# EAGLE board SDA390V1_TASLAK (EAGLE 9.6.2), part 1 of 3
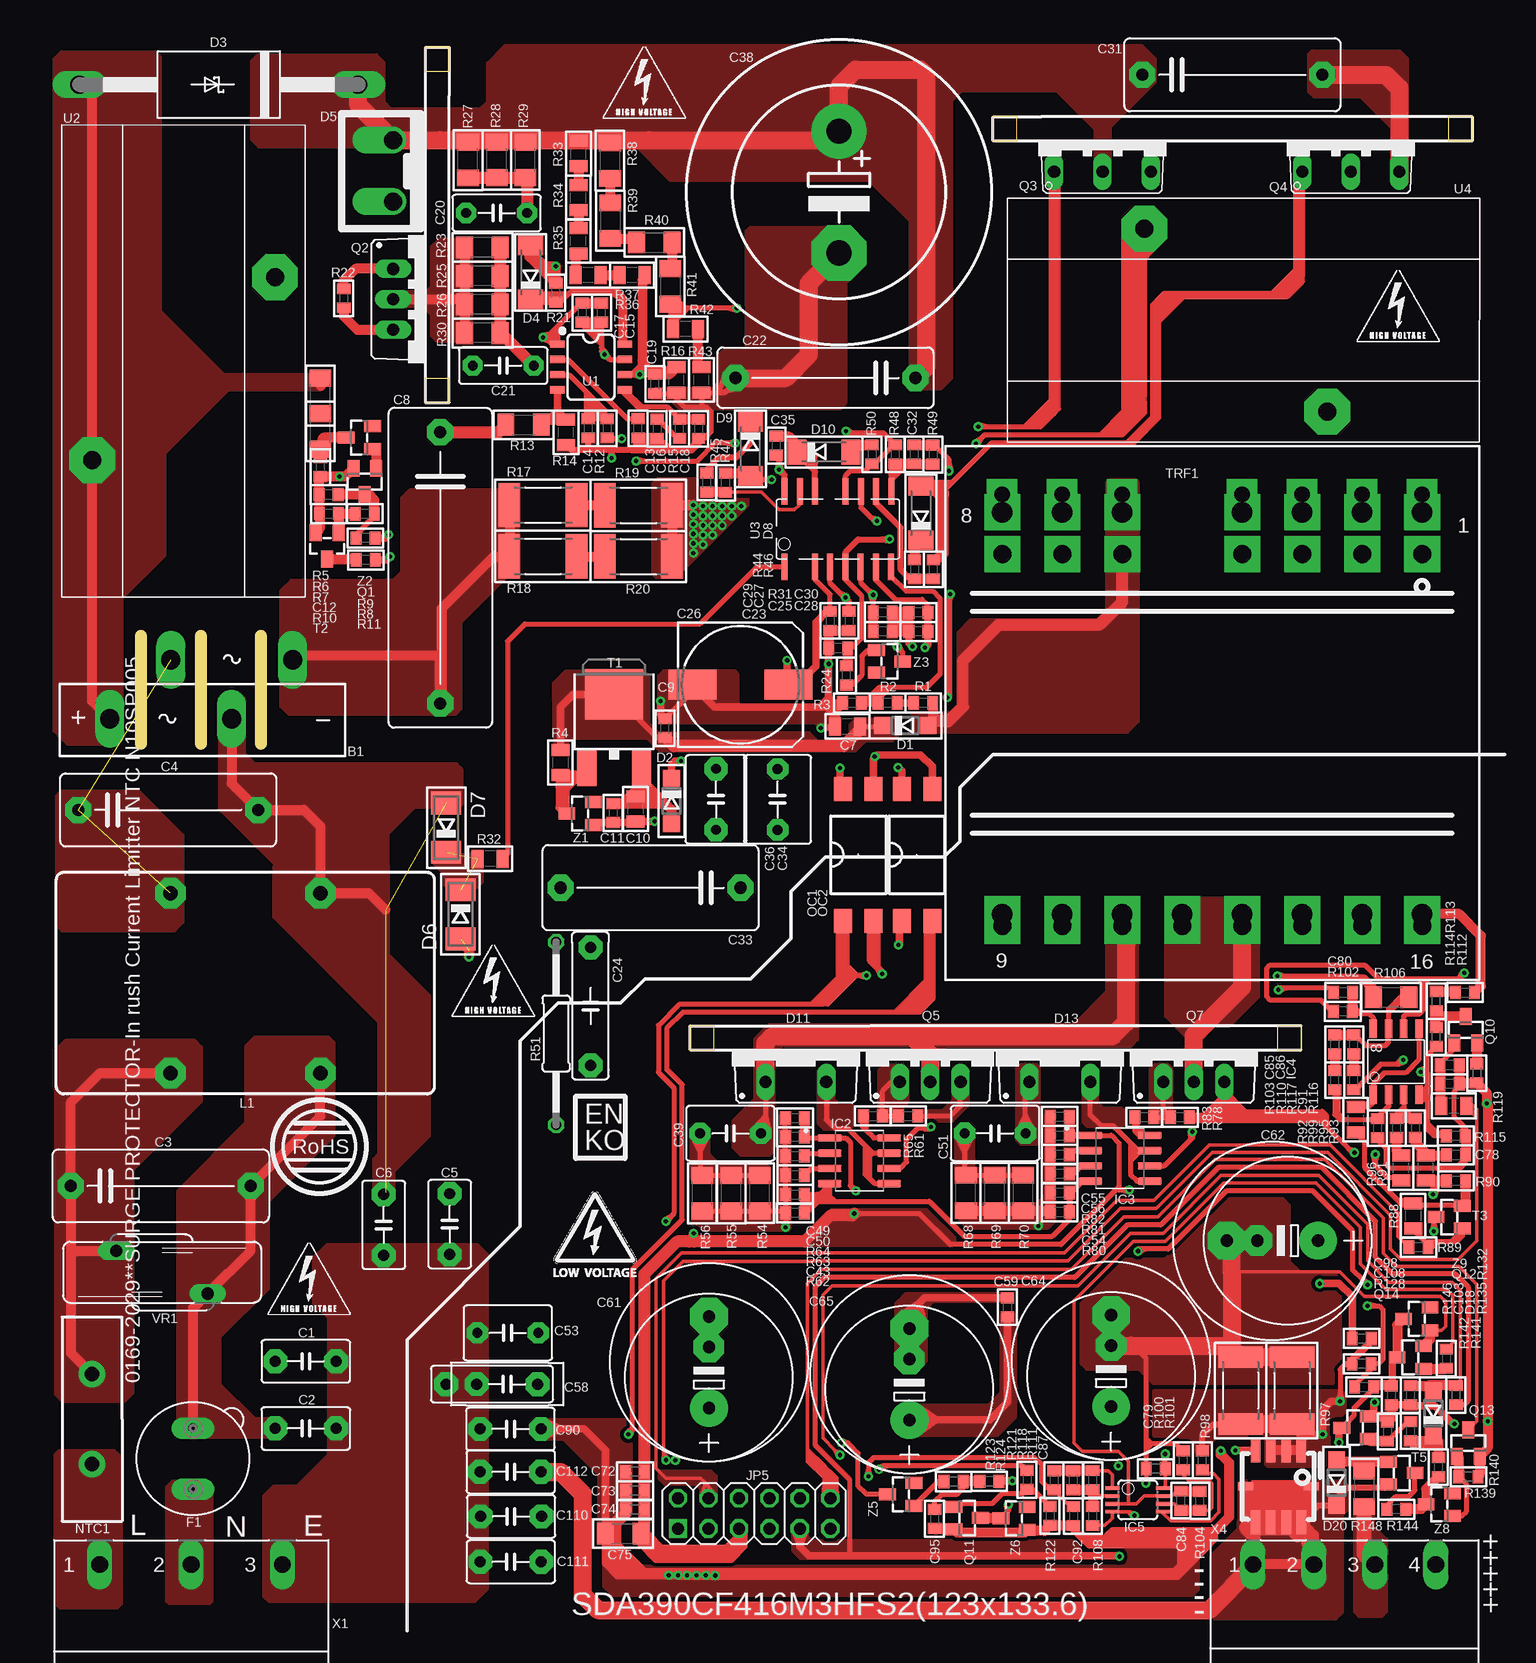
[diagram p5: board, top side]
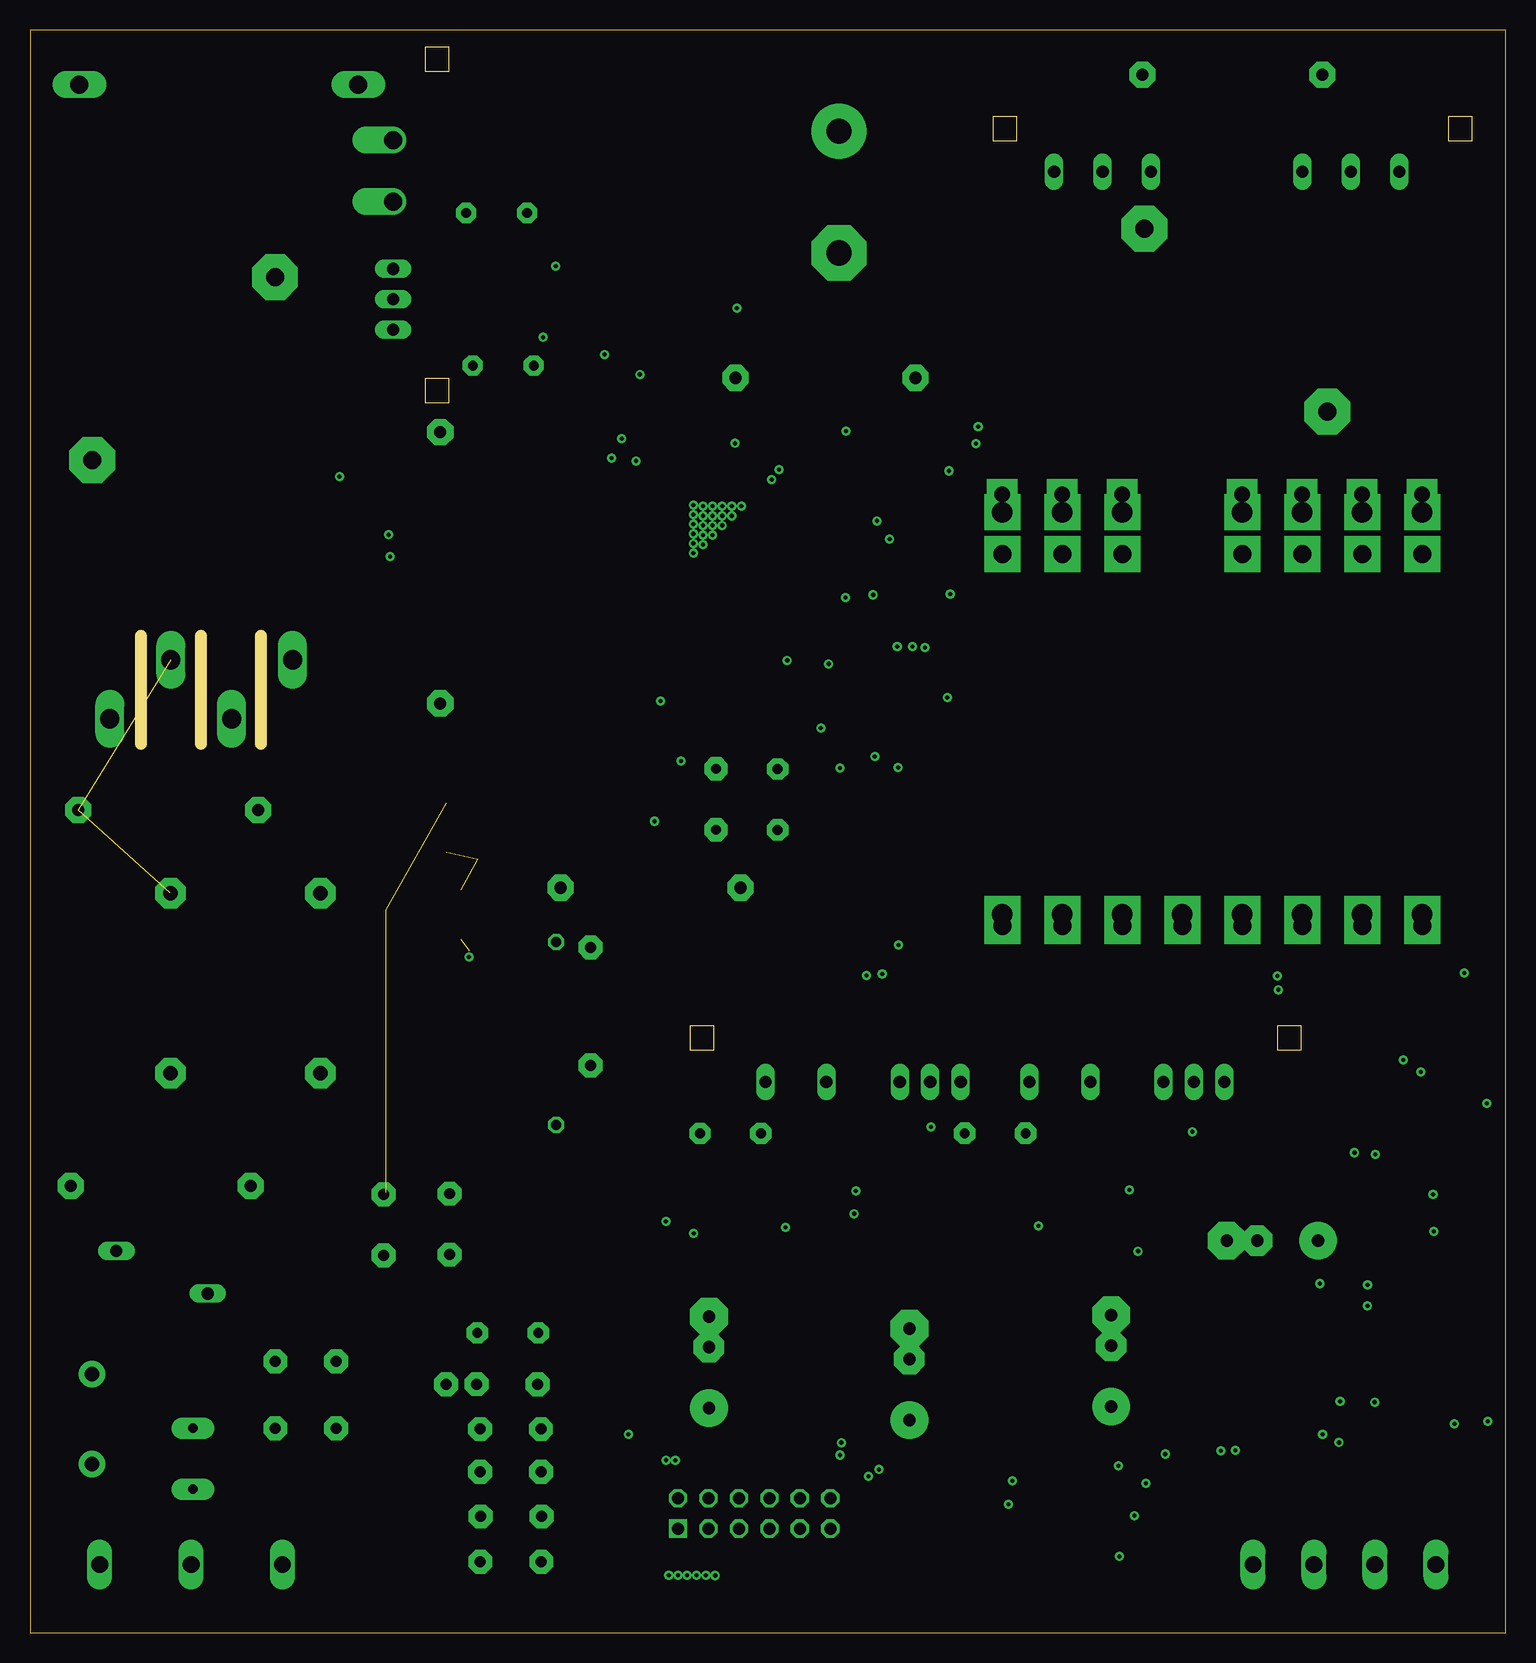
[diagram p6: board, inner layer Route3]
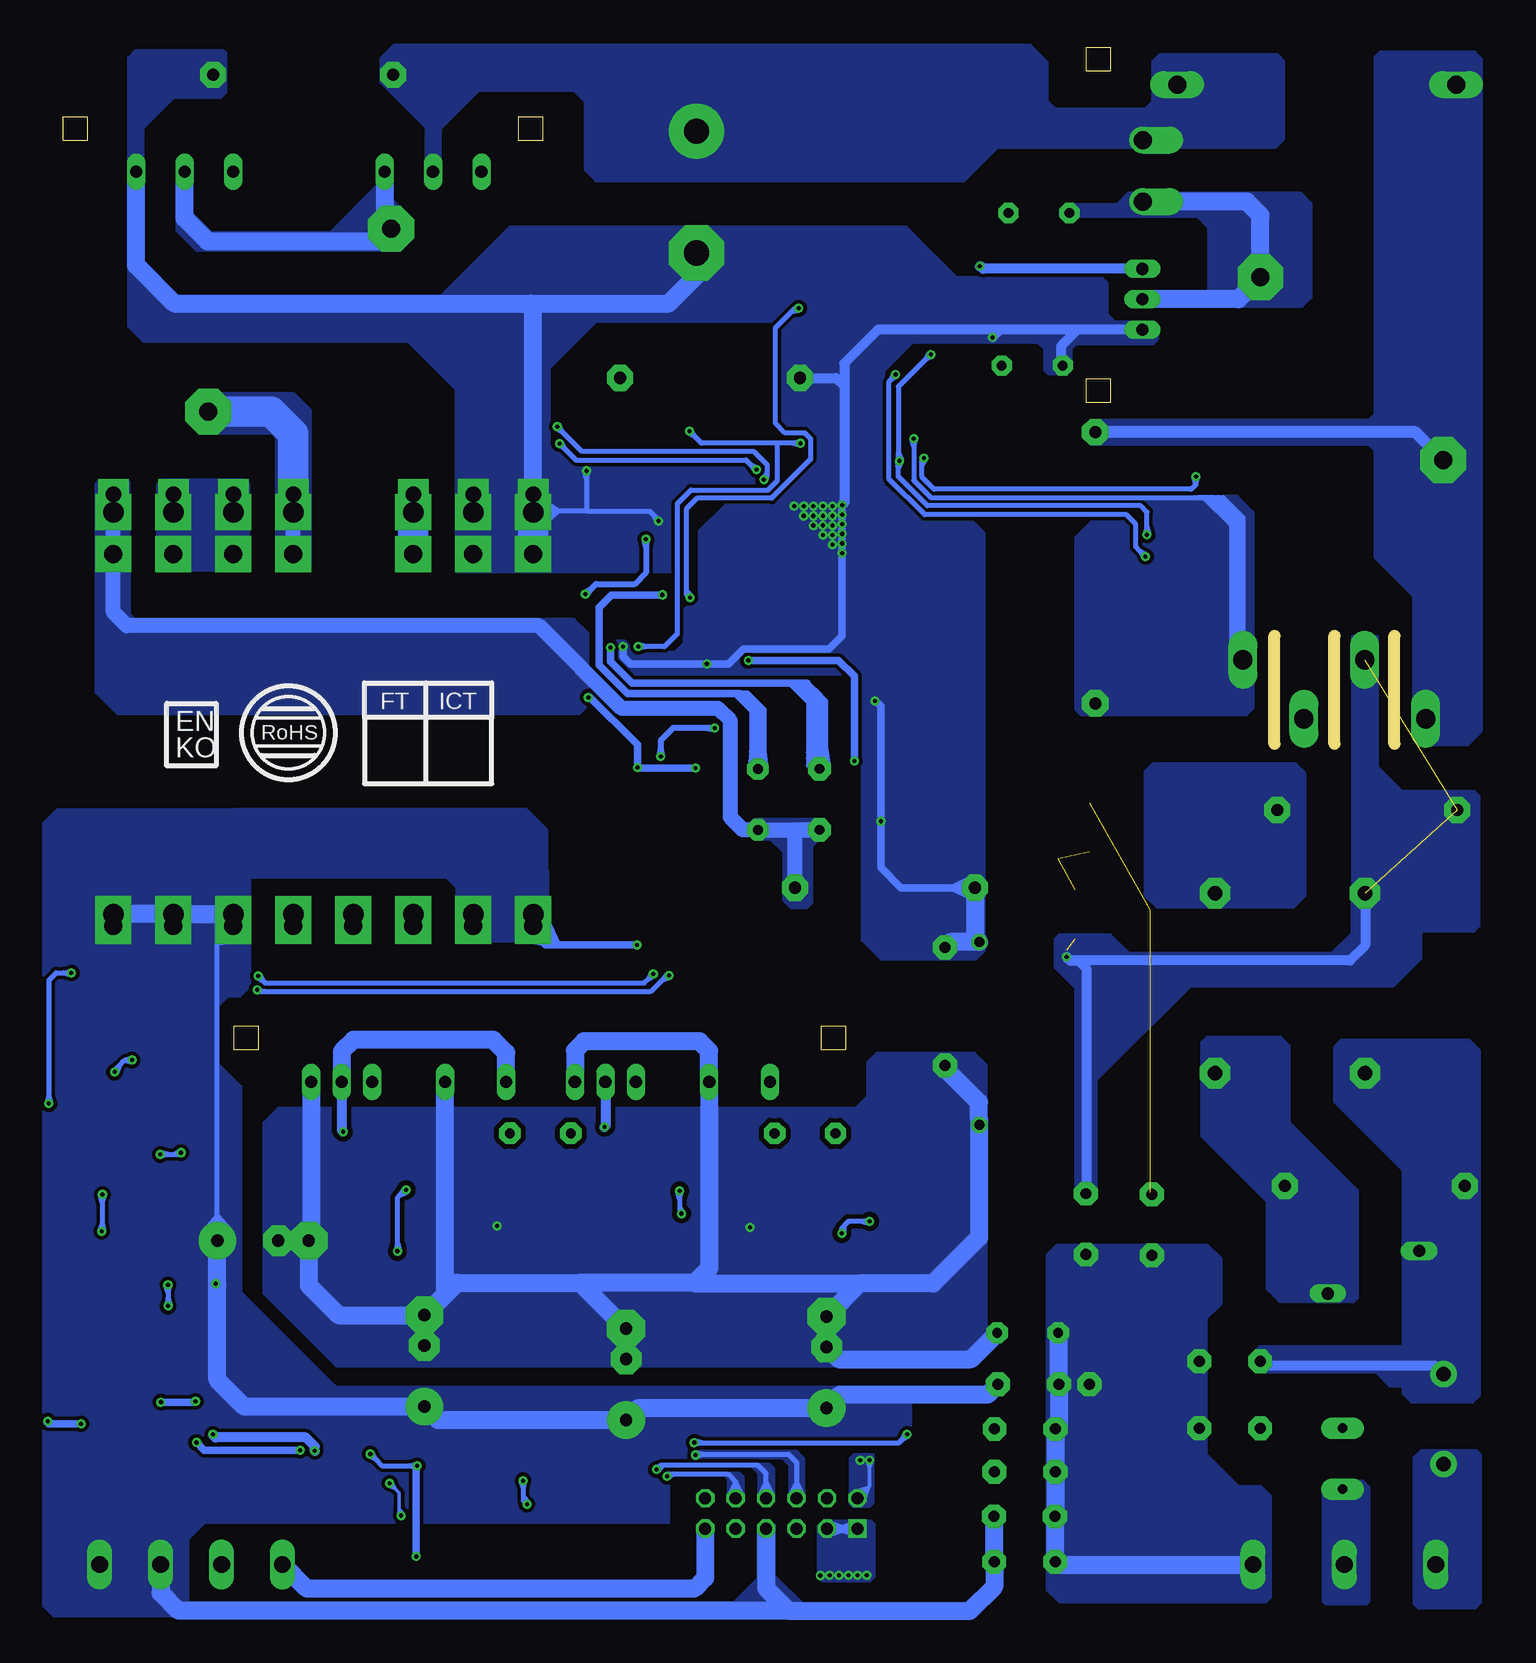
[diagram p7: board, bottom side, seen from below]

No outline drawn. Coordinates in mm, seen from the top.
Copper layers (1*3*16): Top 0.035mm / dielectric 1.53mm / Route3 0mil / dielectric 0mil / Bottom 0.035mm
Design rules "default *": minimum track width 6mil, minimum drill 0.35mm, track to track 11mil, track to pad 11mil, pad to pad 11mil, via to via 11mil, smd to smd 11mil, copper to edge 40mil, drill to drill 6mil, minimum pad ring 10mil, minimum via ring 8mil, stop-mask expansion 4mil, vias tented up to drill 0mil, thermal gap 10mil
Milling: 24 lines

## Footprints (pad centres in the part's own frame; a part is rotated, then mirrored left to right if it is on the bottom)
DıODE_BRIDGE_8A_DIK = drill 1.6 long: + -7.62,0.08; - 7.62,5; AC1 -2.54,5; AC2 2.54,0.08
C050-035X075 = drill 0.914 pad 1.981 octagon: 1 -2.54,0; 2 2.54,0
C150-064X183 = drill 1.016 pad 2.184 octagon: 1 -7.493,0; 2 7.493,0
C0805_ENKO = smd 1 x 1.5: 1 -1.052,0; 2 1.052,0
C225-087X268 = drill 1.016 pad 2.184 octagon: 1 -11.303,0; 2 11.303,0
C0603_ENKO = smd 0.9 x 1.1: 1 -0.794,0; 2 0.794,0
C050-030X075 = drill 0.813 pad 1.676 octagon: 1 -2.54,0; 2 2.54,0
C150-054X183 = drill 1.016 pad 2.184 octagon: 1 -7.493,0; 2 7.493,0
C075-32X103_DEIF = drill 0.914 pad 2 octagon: P$1 -4.92,0; P$2 4.92,0
153CLV-1010 = smd 4 x 2.5: + 4,0; - -4,0
C150-072X183 = drill 1.016 pad 2.184 octagon: 1 -7.493,0; 2 7.493,0
C050-055X075 = drill 0.813 pad 1.778 octagon: 1 -2.54,0; 2 2.54,0
C050-050X075 = drill 0.813 pad 1.93 octagon: 1 -2.54,0; 2 2.54,0
EB25D = drill 2.1 pad 4.597: + -5.08,0 | drill 2.1 pad 4.597 octagon: - 5.08,0
C050-045X075 = drill 0.813 pad 1.778 octagon: 1 -2.54,0; 2 2.54,0
C075-32X103/C050-035X75 = drill 0.914 pad 2 octagon: 1 -3.81,0; 2 3.81,0 | drill 0.914 pad 1.981 octagon: 3 -3.81,0; 4 1.27,0
E5-13/E7,5-16 = drill 1.016 pad 3.15: + -3.81,0 | drill 1.016 pad 2.54: +1 -3.81,0 | drill 1.016 pad 3.15 octagon: - 3.81,0 | drill 1.016 pad 2.54 octagon: -1 1.27,0
C1206_ENKO = smd 1.4 x 1.8: 1 -1.479,0; 2 1.479,0
SOD123 = smd 1.4 x 1.4: A 1.9,0; C -1.9,0
DIODE_D0201-23 = drill 1.499 long: A 11.62,0; C -11.62,0
SOD106-R = smd 1.6 x 2.1: A 2.25,0; C -2.25,0
DIODE_12A_1000V_TO220 = drill 1.5 pad 2.184 offset: A 1.27,-2.54; K 1.27,2.59
M7_DC_DIYOT = smd 1.9 x 2.5: A -2.05,0; C 2.05,0
TO220ACS = drill 1.016 long: A 2.54,-2.54; C -2.54,-2.54
19560 = drill 0.813 pad 1.778 long: 1 -2.54,0; 2 2.54,0
NCP4306 = smd 1.97 x 0.6: 1 -2.475,1.905; 2 -2.475,0.635; 3 -2.475,-0.635; 4 -2.475,-1.905; 5 2.475,-1.905; 6 2.475,-0.635; 7 2.475,0.635; 8 2.475,1.905
SO-8 = smd 1.524 x 0.61: 1 -2.743,1.92; 2 -2.743,0.65; 3 -2.743,-0.62; 4 -2.743,-1.89; 5 2.743,-1.89; 6 2.743,-0.62; 7 2.743,0.65; 8 2.743,1.92
MSOP08 = smd 0.3 x 1.2: 1 -0.976,-2.113; 2 -0.326,-2.113; 3 0.324,-2.113; 4 0.974,-2.113; 5 0.974,2.112; 6 0.324,2.112; 7 -0.326,2.112; 8 -0.976,2.112
TPH6R30ANL = smd 0.8 x 2: D 1.905,3; D1 0.635,3; D2 -0.635,3; D3 -1.905,3; GATE 1.905,-3; S -1.905,-3; S1 -0.635,-3; S2 0.635,-3 | smd 1.27 x 0.635: P$1 -2.75,0; P$2 2.75,0
2X06 = drill 1 square: 1 -6.35,-1.27 | drill 1 octagon: 2 -6.35,1.27; 3 -3.81,-1.27; 4 -3.81,1.27; 5 -1.27,-1.27; 6 -1.27,1.27; 7 1.27,-1.27; 8 1.27,1.27; 9 3.81,-1.27; 10 3.81,1.27; 11 6.35,-1.27; 12 6.35,1.27
EPCOS_B82724J = drill 1.2 pad 2.54 octagon: 1 -7.5,-6.25; 2 -7.5,6.25; 3 7.5,6.25; 4 7.5,-6.25
SENS_NTC = drill 1.2 pad 2.184: P$1 3.75,0; P$2 -3.75,0
PS2561DL2-1_OPTO1 = smd 1.5 x 2: 1 -1.27,-5.5; 2 1.27,-5.5; 3 1.27,5.5; 4 -1.27,5.5
SOT23 = smd 1 x 1.4: 1 -0.95,-1.1; 2 0.95,-1.1; 3 0,1.1
TO220BV = drill 1.016 long: D 0,-2.54; G -2.54,-2.54; S 2.54,-2.54
ISO_TO_220 = drill 1.016 long: 1 -4.04,-0.04; 2 0,-0.04; 3 4.04,-0.04
R0603_ENKO = smd 0.9 x 1.1: 1 -0.794,0; 2 0.794,0
R0805_ENKO = smd 1 x 1.5: 1 -1.052,0; 2 1.052,0
R1206_ENKO = smd 1.4 x 1.8: 1 -1.479,0; 2 1.479,0
R2512 = smd 1.8 x 3.7: 1 -2.8,0; 2 2.8,0
0207/15 = drill 0.813 octagon: 1 -7.62,0; 2 7.62,0
DPAK = smd 1.6 x 3: 1 -2.28,-4.04; 3 2.28,-4.04 | smd 4.826 x 4.191: 4 0,2.096
SOT-23 = smd 1 x 1.4: 1 0,1.1; 2 0.95,-1.1; 3 -0.95,-1.1
SOT23-BEC = smd 1 x 1.4: B -0.95,-1.1; C 0,1.1; E 0.95,-1.1
DEIF_TRF_300W_2 = drill 1.7 pad 3 square: 1 -16.75,12.5; 2 -16.75,7.5; 3 -16.75,2.5; 4 -16.75,-17.5; 5 -16.75,-7.5; 6 -16.75,-12.5; 6.5 16.75,-17.5; 7 16.75,-12.5; 8 16.75,-7.5; 9 16.75,-2.5; 10 16.75,2.5; 11 16.75,7.5; 12 16.75,12.5; 13 16.75,17.5; 55 -16.75,17.5 | drill 1.5 pad 3 square: 6.1 17.745,-17.5; 6.2 16.75,-17.5; 19 17.745,12.5; 20 17.745,7.5; 21 17.745,2.5; 22 17.745,-2.5; 23 17.745,-7.5; 24 17.745,-12.5; 25 17.745,17.5; 27 16.75,-12.5; 28 16.75,-7.5; 29 16.75,-2.5; 30 16.75,2.5; 31 16.75,7.5; 32 16.75,12.5; 38 16.75,17.5; 40 16.75,-17.5; 41 16.75,-12.5; 42 16.75,-7.5; 43 16.75,-2.5; 44 16.75,2.5; 45 16.75,7.5; 46 16.75,12.5; 47 16.75,17.5; 48 -13.25,-17.5; 49 -13.25,-12.5; 50 -13.25,-7.5; 52 -13.25,2.5; 53 -13.25,7.5; 54 -13.25,12.5; 58 -13.25,17.5 | drill 1.3 pad 2.54 square: 14 -18.255,-12.5; 15 -18.255,-7.5; 16 -18.255,2.5; 17 -18.255,7.5; 18 -18.255,12.5; 26 -18.25,-17.5; 33 -18.25,-12.5; 34 -18.25,-7.5; 35 -18.25,2.5; 36 -18.25,7.5; 37 -18.25,12.5; 39 -18.255,-17.5; 56 -18.255,17.5; 57 -18.25,17.5
UCC28180 = smd 0.6 x 1.2: 1 -1.905,-2.8; 2 -0.635,-2.8; 3 0.635,-2.8; 4 1.905,-2.8; 5 1.905,2.8; 6 0.635,2.8; 7 -0.635,2.8; 8 -1.905,2.8
IND_TOROID = drill 1.5 pad 3.81 octagon: 1 -7.62,7.62; 2 7.62,-7.62
SOIC16_UCC256301 = smd 0.5 x 2.2: 1 -4.445,-3.154; 3 -1.915,-3.154; 4 -0.645,-3.154; 5 0.635,-3.154; 6 1.895,-3.154; 7 3.165,-3.154; 8 4.435,-3.154; 9 4.445,3.154; 10 3.175,3.154; 11 1.905,3.154; 12 0.635,3.154; 14 -1.905,3.154; 15 -3.175,3.154; 16 -4.445,3.154
VITRA_VARISTOR = drill 1.016 long: 1 -3.81,1.778; 2 3.81,-1.778
GMSTBA3 = drill 1.397 long: 1 -7.62,5.08; 2 0,5.08; 3 7.62,5.08
MSTBA4 = drill 1.397 long: 1 -7.62,5.08; 2 -2.54,5.08; 3 2.54,5.08; 4 7.62,5.08

## Placement (x,y rotation side)
B1  0119-1152**DIODE BRIDGE 8A 800V 4-SIP, GBU  [DıODE_BRIDGE_8A_DIK]  -108.73,76.1 0 top
C1  NC**TAKILMAYACAK  [C050-035X075]  -100.01,22.63 0 top
C2  NC**TAKILMAYACAK  [C050-035X075]  -100.01,17.03 0 top
C3  0019-1383**CAP TH POLY 220nF 305Vac 105C %20 X2 F=15/7x13.5x18  [C150-064X183]  -112.1,37.24 0 top
C4  0019-1383**CAP TH POLY 220nF 305Vac 105C %20 X2 F=15/7x13.5x18  [C150-064X183]  -111.48,68.59 0 top
C5  1200920067**CAP TH CER 2.2nF 250Vac %20 X1Y2 F=5mm FORMLU  [C050-035X075]  -88.02,34.06 270 top
C6  1200920067**CAP TH CER 2.2nF 250Vac %20 X1Y2 F=5mm FORMLU  [C050-035X075]  -93.52,34 270 top
C7  1019-3243**CAP 0805 CER 10uF 50V ±10% X5R -55°C ~ 85°C  [C0805_ENKO]  -54.85,75.55 0 top
C8  NC**TAKILMAYACAK  [C225-087X268]  -88.8,88.77 270 top
C9  1200920268**CAP 0603 CER 100nF 50V %10 X7R  [C0603_ENKO]  -70.07,75.39 270 top
C10  1019-3243**CAP 0805 CER 10uF 50V ±10% X5R -55°C ~ 85°C  [C0805_ENKO]  -72.51,68.66 90 top
C11  1200920268**CAP 0603 CER 100nF 50V %10 X7R  [C0603_ENKO]  -74.38,68.33 90 top
C12  1200920567**CAP 0603 CER 1uF 25V %10X7R  [C0603_ENKO]  -98.1,94.87 180 top
C13  1409-0021**CAP 0603 CER 2.2nf 50V %10 X7R  [C0603_ENKO]  -72.32,100.4 270 top
C14  1019-3157**CAP 0603 CER 1.5nF 50V %10 X7R (AbC)  [C0603_ENKO]  -76.46,100.4 270 top
C15  1200920268**CAP 0603 CER 100nF 50V %10 X7R  [C0603_ENKO]  -75.37,110.04 90 top
C16  1019-3366**CAP 0603 CER 10uF 16V %20 X5R  [C0603_ENKO]  -70.72,100.36 270 top
C17  1019-3366**CAP 0603 CER 10uF 16V %20 X5R  [C0603_ENKO]  -76.96,110.04 90 top
C18  1019-3362**CAP 0603 CER 2.2uF 10V %10 X5R  [C0603_ENKO]  -67.26,100.35 270 top
C19  1409-0019**CAP 0603 CER 390pf 50V %5 NPO(COG)  [C0603_ENKO]  -70.91,104.1 270 top
C20  NC**TAKILMAYACAK  [C050-030X075]  -84.1,118.35 0 top
C21  NC**TAKILMAYACAK  [C050-030X075]  -83.55,105.63 0 top
C22  1200920389**CAP TH POLY 150nF 305 Vac %20 X2 105C F=15mm  [C150-054X183]  -56.69,104.6 180 top
C23  1200920253**CAP 0603 CER 10n 50V%10 X7R  [C0603_ENKO]  -55.63,82.08 180 top
C24  NC**TAKILMAYACAK  [C075-32X103_DEIF]  -76.28,52.22 270 top
C25  1200920268**CAP 0603 CER 100nF 50V %10 X7R  [C0603_ENKO]  -51.92,83.46 0 top
C26  1019-5003**CAP.EL.470uF 35V 10X10.5 20% SMD  [153CLV-1010]  -63.78,79.02 0 top
C27  1200920268**CAP 0603 CER 100nF 50V %10 X7R  [C0603_ENKO]  -56.31,84.35 270 top
C28  1019-3011**CAP 0805 CER 4.7nF 50V %10 X7R  [C0603_ENKO]  -48.94,83.46 180 top
C29  1200920253**CAP 0603 CER 10n 50V%10 X7R  [C0603_ENKO]  -54.72,84.34 90 top
C30  1019-3009**CAP 0805 CER 3.3nF 50V %10 X7R  [C0603_ENKO]  -48.94,85.05 180 top
C31  NC**TAKILMAYACAK  [C150-064X183]  -22.77,129.87 0 top
C32  1200920253**CAP 0603 CER 10n 50V%10 X7R  [C0603_ENKO]  -49.3,98.22 90 top
C33  0019-1345**CAP TH POLY 10nF 600VAC 1000VDC MKP %5 85C F=15/5x11x18 (AbC)  [C150-072X183]  -71.27,62.1 180 top
C34  0019-5004**CAP TH CER 100pF 1kV Y5V %10 85C F=5  [C050-055X075]  -60.68,69.46 90 top
C35  1019-3365**CAP 603 CER 10uF 25V ±10% X5R -55°C ~ 85°C  [C0603_ENKO]  -60.8,98.95 90 top
C36  0019-5004**CAP TH CER 100pF 1kV Y5V %10 85C F=5  [C050-050X075]  -65.81,69.47 90 top
C38  1200920352**CAP TH AL. ELEC 100uF 450V %20 105C SNP F=10/25.4X30  [EB25D]  -55.56,120.09 270 top
C39  0019-1391**CAP TH CER 4700pF 250VAC 2.5kVDC X1Y2 %20 85C F=5mm  [C050-045X075]  -64.61,41.62 180 top
C43  1200920268**CAP 0603 CER 100nF 50V %10 X7R  [C0603_ENKO]  -59.22,36.53 0 top
C49  1200920268**CAP 0603 CER 100nF 50V %10 X7R  [C0603_ENKO]  -59.23,42.91 0 top
C50  1200920567**CAP 0603 CER 1uF 25V %10X7R  [C0603_ENKO]  -59.23,41.34 0 top
C51  0019-1391**CAP TH CER 4700pF 250VAC 2.5kVDC X1Y2 %20 85C F=5mm  [C050-045X075]  -42.55,41.63 180 top
C53  0019-1391**CAP TH CER 4700pF 250VAC 2.5kVDC X1Y2 %20 85C F=5mm  [C050-045X075]  -83.17,24.99 180 top
C54  1200920268**CAP 0603 CER 100nF 50V %10 X7R  [C0603_ENKO]  -37.16,36.68 0 top
C55  1200920268**CAP 0603 CER 100nF 50V %10 X7R  [C0603_ENKO]  -37.16,43.02 0 top
C56  1200920567**CAP 0603 CER 1uF 25V %10X7R  [C0603_ENKO]  -37.16,41.44 0 top
C58  1200920292**CAP TH CER 2.2nF 300Vac %20 X1Y2 F=7.5mm DxS(13x5)  [C075-32X103/C050-035X75]  -84.49,20.72 180 top
C59  1200920268**CAP 0603 CER 100nF 50V %10 X7R  [C0603_ENKO]  -41.52,27.13 90 top
C61  0019-3046**CAP TH AL ELEC 1000uF 35V %20 105C F=5/12.5x25 LOW ESR  [E5-13/E7,5-16]  -66.4,22.54 90 top
C62  0019-3046**CAP TH AL ELEC 1000uF 35V %20 105C F=5/12.5x25 LOW ESR  [E5-13/E7,5-16]  -19.43,32.68 180 top
C64  NC**TAKILMAYACAK  [E5-13/E7,5-16]  -32.88,22.66 90 top
C65  NC**TAKILMAYACAK  [E5-13/E7,5-16]  -49.69,21.54 90 top
C72  NC**TAKILMAYACAK  [C0603_ENKO]  -72.57,13.42 180 top
C73  1200920268**CAP 0603 CER 100nF 50V %10 X7R  [C0603_ENKO]  -72.57,11.84 180 top
C74  1200920567**CAP 0603 CER 1uF 25V %10X7R  [C0603_ENKO]  -72.57,10.27 180 top
C75  1200920197**CAP 1206 CER 10uF 25V %10 X7R  [C1206_ENKO]  -73.56,8.28 180 top
C78  1019-3387**CAP 0603 CER 10uF 10V %10 X5R  [C0603_ENKO]  -4.12,39.83 180 top
C79  1200920268**CAP 0603 CER 100nF 50V %10 X7R  [C0603_ENKO]  -29.16,13.68 180 top
C80  1200920268**CAP 0603 CER 100nF 50V %10 X7R  [C0603_ENKO]  -13.56,51.79 0 top
C84  NC**TAKILMAYACAK (Not Fitted)  [C0603_ENKO]  -27.07,11.01 90 top
C85  1200920567**CAP 0603 CER 1uF 25V %10X7R  [C0603_ENKO]  -14.23,49.04 90 top
C86  1019-3167**CAP 0603 CER 10nF 50V %10 X7R (AbC)  [C0603_ENKO]  -12.65,49.04 90 top
C87  1200920371**CAP 0603 CER 150p 50V%5 COG  [C0603_ENKO]  -34.41,12.72 90 top
C90  NC**TAKILMAYACAK (Not Fitted)  [C050-035X075]  -82.95,16.98 0 top
C91  1019-3387**CAP 0603 CER 10uF 10V %10 X5R  [C0603_ENKO]  -4.66,45.75 180 top
C92  1200920268**CAP 0603 CER 100nF 50V %10 X7R  [C0603_ENKO]  -36.01,9.73 90 top
C95  1200920268**CAP 0603 CER 100nF 50V %10 X7R  [C0603_ENKO]  -47.59,9.49 90 top
C98  1200920268**CAP 0603 CER 100nF 50V %10 X7R  [C0603_ENKO]  -12,22.42 0 top
C103  1200920268**CAP 0603 CER 100nF 50V %10 X7R  [C0603_ENKO]  -7.92,19.8 270 top
C108  1019-3167**CAP 0603 CER 10nF 50V %10 X7R (AbC)  [C0603_ENKO]  -11.99,24.52 180 top
C110  0019-1391**CAP TH CER 4700pF 250VAC 2.5kVDC X1Y2 %20 85C F=5mm  [C050-035X075]  -82.9,9.69 180 top
C111  0019-1391**CAP TH CER 4700pF 250VAC 2.5kVDC X1Y2 %20 85C F=5mm  [C050-035X075]  -82.92,5.91 180 top
C112  0019-1391**CAP TH CER 4700pF 250VAC 2.5kVDC X1Y2 %20 85C F=5mm  [C050-035X075]  -82.93,13.41 0 top
D1  1200980377**DIODE SWITCHING SMD 75V 200mA SOD-123 1N4148W  [SOD123]  -50.04,75.62 0 top
D2  1200980377**DIODE SWITCHING SMD 75V 200mA SOD-123 1N4148W  [SOD123]  -69.52,69.33 270 top
D3  0119-1172**UF5408 1000V 3A DO-201AD  [DIODE_D0201-23]  -107.26,129.04 180 top
D4  1200980565**DIODE SCHOTTKY SMD 40V 1A MBRA140T3G  [SOD106-R]  -81.27,113.39 90 top
D5  0119-5001**Diode SIC Schottky 600V 4A TO220-2 C3D04060A  [DIODE_12A_1000V_TO220]  -94.02,121.83 0 top
D6  1200980002**DIODE RECTIFIER SMD 1000V 1A SM4007  [M7_DC_DIYOT]  -87.11,59.88 90 top
D7  1200980002**DIODE RECTIFIER SMD 1000V 1A SM4007  [M7_DC_DIYOT]  -88.3,67.11 270 top
D8  NC**TAKILMAYACAK  [SOD106-R]  -48.74,93.33 90 top
D9  NC**TAKILMAYACAK  [SOD106-R]  -62.93,98.69 270 top
D10  1200980554**DIODE SWITCHING SM 1000V 1A US1M  [SOD106-R]  -56.81,98.42 0 top
D11  0119-1191**DIODE 12A 1000V TO-220Ins ST STTH1210DI (MX322)  [TO220ACS]  -59.16,48.46 0 top
D13  0119-1191**DIODE 12A 1000V TO-220Ins ST STTH1210DI (MX322)  [TO220ACS]  -37.15,48.46 0 top
D18  1200980377**DIODE SWITCHING SMD 75V 200mA SOD-123 1N4148W  [SOD123]  -6.03,18.29 90 top
D20  1200980377**DIODE SWITCHING SMD 75V 200mA SOD-123 1N4148W  [SOD123]  -14.09,12.51 90 top
F1  0169-2041**SIGORTA 6.3A FAST-ACTING TR5 SERISI SILINDIRIK TIP  [19560]  -109.41,14.51 90 top
IC2  1039-9013**NCP4306AADZZZADR2G SOIC-8 (senkron IC) Synchronous Rectification Controller for Flyback  [NCP4306]  -53.86,39.34 0 top
IC3  1039-9013**NCP4306AADZZZADR2G SOIC-8 (senkron IC) Synchronous Rectification Controller for Flyback  [NCP4306]  -32.13,39.55 0 top
IC4  1039-2224**TSM1011ID SO-8 Constant Voltage and Constant Current Controller  [SO-8]  -9.11,47.6 90 top
IC5  1039-2382**LMV358LIST 8-MiniSO Rail to Rail Opamp 2.7-5.5V  [MSOP08]  -30.66,11.07 270 top
IC8  1109-4211**Mosfet N-Ch 100V 90A Rds:3.7mR 8-SOP Advance (5x5) TPH3R70APL  [TPH6R30ANL]  -18.94,12.2 180 top
JP5  [2X06]  -62.64,9.95 0 top
L1  0319-7034**LINE FILTER 2x3.3mH 6A common mode choke  [EPCOS_B82724J]  -105.05,54.15 90 top
NTC1  0169-2029**SURGE PROTECTOR-In rush Current Limitter NTC N10SP005  [SENS_NTC]  -117.83,17.8 90 top
OC1  1200980560**OPTOCOUPLER SMD PS2561DL2-1Y-V-F3-A/L CTR Rank:L  [PS2561DL2-1_OPTO1]  -53.94,64.84 0 top
OC2  1200980560**OPTOCOUPLER SMD PS2561DL2-1Y-V-F3-A/L CTR Rank:L  [PS2561DL2-1_OPTO1]  -49.06,64.83 0 top
PCB  0369-5026**PCB [ARGE?] SDA390CF416M3HFS2(123x133,6)  [PCB]  -103.31,141.3 0 top
Q1  1200980090**TRANS SMD NPN BC847B SOT-23  [SOT23]  -95.09,95.96 180 top
Q2  0109-4085**Mosfet N-Ch 600V 20.6A 190mohm TO-220 FCP190N60E  [TO220BV]  -90.19,111.15 270 top
Q3  0109-4091**Mosfet N-Ch 800V 9A 0.16R TO-220FP Vishay SIHA24N80AE-GE3  [ISO_TO_220]  -33.59,121.83 0 top
Q4  0109-4091**Mosfet N-Ch 800V 9A 0.16R TO-220FP Vishay SIHA24N80AE-GE3  [ISO_TO_220]  -12.89,121.83 0 top
Q5  NC**TAKILMAYACAK 0109-4112**Mosfet N-Ch 27.4A 150V Rds:19mR TO-220F Fairchild FDPF190N15A  [TO220BV]  -47.96,48.46 0 top
Q7  NC**TAKILMAYACAK 0109-4112**Mosfet N-Ch 27.4A 150V Rds:19mR TO-220F Fairchild FDPF190N15A  [TO220BV]  -25.99,48.46 0 top
Q10  1200980090**TRANS SMD NPN BC847B SOT-23  [SOT23]  -3.32,50.26 0 top
Q11  1200980090**TRANS SMD NPN BC847B SOT-23  [SOT23]  -44.87,9.56 270 top
Q12  1200980090**TRANS SMD NPN BC847B SOT-23  [SOT23]  -7.94,22.95 90 top
Q13  NC**TAKILMAYACAK  [SOT23]  -3.1,15.81 0 top
Q14  1200980090**TRANS SMD NPN BC847B SOT-23  [SOT23]  -12.54,17.1 90 top
R1  1029-6060**RES 0805 62K %1 (AbC)  [R0603_ENKO]  -48.54,77.51 180 top
R2  1200970516**RES 0603 22K %5 1/10W  [R0603_ENKO]  -51.51,77.51 180 top
R3  1200971020**RES 0603 10K %1 1/10W  [R0603_ENKO]  -54.48,77.51 0 top
R4  1029-6030**RES 0805 1K5 %1  [R0805_ENKO]  -78.79,72.53 270 top
R5  1200970179**RES 1206 330K %5 1/4W  [R1206_ENKO]  -98.8,103.11 270 top
R6  1029-3180**RES 0805 300K %1 (AbC)  [R1206_ENKO]  -98.8,100.14 270 top
R7  1200970684**RES 0603 47K %1 1/10W  [R0603_ENKO]  -98.79,97.17 90 top
R8  1200970569**RES 0603 33K %5 1/10W  [R0603_ENKO]  -95.03,91.25 0 top
R9  1200970515**RES 0603 100K %5 1/10W  [R0603_ENKO]  -95.09,93.27 0 top
R10  1200970516**RES 0603 22K %5 1/10W  [R0603_ENKO]  -98.08,93.28 0 top
R11  1200970528**RES 0603 0R %5 1/10W  [R0603_ENKO]  -95.01,89.43 0 top
R12  1029-2005**RES 0603 220R %1  [R0603_ENKO]  -74.89,100.39 90 top
R13  NC**TAKILMAYACAK - 1200970272**RES 1206 6M8 %1 1/4W  [R1206_ENKO]  -81.85,100.7 180 top
R14  1200970174**RES 0805 33K %1 1/8W  [R0805_ENKO]  -78.31,100.06 90 top
R15  1029-2341**RES 0603 5K6 %1  [R0603_ENKO]  -68.86,100.36 90 top
R16  1029-3200**RES 0805 18K %1 (AbC)  [R0805_ENKO]  -69.1,104.44 90 top
R17  NC**TAKILMAYACAK  [R2512]  -80.24,94 0 top
R18  1029-6021**RES 2512 0R003 %1 2W  [R2512]  -80.24,89.72 0 top
R19  NC**TAKILMAYACAK  [R2512]  -72.28,93.98 0 top
R20  1029-6021**RES 2512 0R003 %1 2W  [R2512]  -72.28,89.71 0 top
R21  1200970627**RES 0603 100R %5 1/10W  [R0603_ENKO]  -79.17,111.7 270 top
R22  1200970518**RES 0603 10K %5 1/10W  [R0603_ENKO]  -96.84,111.22 270 top
R23  NC**TAKILMAYACAK  [R1206_ENKO]  -85.28,115.46 0 top
R24  1200970746**RES 0603 10K %1 1/10W  [R0603_ENKO]  -54.94,79.8 90 top
R25  NC**TAKILMAYACAK  [R1206_ENKO]  -85.28,113.08 0 top
R26  NC**TAKILMAYACAK  [R1206_ENKO]  -85.28,110.71 0 top
R27  NC**TAKILMAYACAK  [R1206_ENKO]  -86.48,122.75 270 top
R28  NC**TAKILMAYACAK  [R1206_ENKO]  -84.1,122.76 270 top
R29  NC**TAKILMAYACAK  [R1206_ENKO]  -81.72,122.76 270 top
R30  NC**TAKILMAYACAK  [R1206_ENKO]  -85.28,108.33 0 top
R31  1029-3039**RES 0805 68R %5  [R0603_ENKO]  -51.92,85.06 0 top
R32  1200970449**RES 0805 5K1 %1 1/8W  [R0805_ENKO]  -84.65,64.51 180 top
R33  1029-3201**RES 0805 220K %1 (AbC)  [R0805_ENKO]  -77.27,123.3 90 top
R34  1029-3176**RES 0805 270K %1  [R0805_ENKO]  -77.29,119.63 90 top
R35  1029-3176**RES 0805 270K %1  [R0805_ENKO]  -77.29,116.02 90 top
R36  1029-3176**RES 0805 270K %1  [R0805_ENKO]  -76.48,113.17 180 top
R37  1029-3196**RES 0805 470K %1 (AbC)  [R0805_ENKO]  -72.82,113.16 180 top
R38  1200970179**RES 1206 330K %5 1/4W  [R1206_ENKO]  -74.65,122.7 90 top
R39  1200970179**RES 1206 330K %5 1/4W  [R1206_ENKO]  -74.63,117.7 90 top
R40  1200970179**RES 1206 330K %5 1/4W  [R1206_ENKO]  -70.96,115.9 180 top
R41  1200970179**RES 1206 330K %5 1/4W  [R1206_ENKO]  -69.62,112.22 90 top
R42  1200970124**RES 0805 10K %5 1/8W  [R0805_ENKO]  -68.36,108.66 180 top
R43  1200970116**RES 0805 0R %5  [R0805_ENKO]  -67.03,104.44 90 top
R44  NC**TAKILMAYACAK  [R0603_ENKO]  -49.26,88.64 90 top
R45  NC**TAKILMAYACAK  [R0603_ENKO]  -66.58,95.88 90 top
R46  1029-2006**RES 0603 47R %1  [R0603_ENKO]  -47.7,88.64 90 top
R47  1029-2006**RES 0603 47R %1  [R0603_ENKO]  -65.02,95.86 90 top
R48  NC**TAKILMAYACAK  [R0603_ENKO]  -50.87,98.22 270 top
R49  1200970803**RES 0603 100K %1 1/10W  [R0603_ENKO]  -47.72,98.21 90 top
R50  1029-2003**RES 0603 10R %1  [R0603_ENKO]  -52.81,98.22 90 top
R51  NC**TAKILMAYACAK  [0207/15]  -79.14,49.95 270 top
R54  1029-4045**RES 1206 22R %5  [R1206_ENKO]  -62.18,36.64 270 top
R55  NC**TAKILMAYACAK  [R1206_ENKO]  -64.55,36.63 270 top
R56  1029-4045**RES 1206 22R %5  [R1206_ENKO]  -66.96,36.63 270 top
R61  1200970568**RES 0603 47K %5 1/10W  [R0603_ENKO]  -49.8,43.07 0 top
R62  1200970568**RES 0603 47K %5 1/10W  [R0603_ENKO]  -59.23,35 180 top
R63  1200971020**RES 0603 10K %1 1/10W  [R0603_ENKO]  -59.22,38.14 180 top
R64  1200970516**RES 0603 22K %5 1/10W  [R0603_ENKO]  -59.22,39.74 180 top
R65  1200970528**RES 0603 0R %5 1/10W  [R0603_ENKO]  -52.73,43.07 0 top
R68  1029-4045**RES 1206 22R %5  [R1206_ENKO]  -44.98,36.66 270 top
R69  NC**TAKILMAYACAK  [R1206_ENKO]  -42.6,36.66 270 top
R70  1029-4045**RES 1206 22R %5  [R1206_ENKO]  -40.21,36.66 270 top
R78  1200970568**RES 0603 47K %5 1/10W  [R0603_ENKO]  -27.15,42.97 0 top
R80  1200970568**RES 0603 47K %5 1/10W  [R0603_ENKO]  -37.16,35.08 180 top
R81  1200971020**RES 0603 10K %1 1/10W  [R0603_ENKO]  -37.16,38.27 180 top
R82  1200970516**RES 0603 22K %5 1/10W  [R0603_ENKO]  -37.16,39.85 180 top
R83  1200970528**RES 0603 0R %5 1/10W  [R0603_ENKO]  -30.1,42.97 0 top
R88  1200970126**RES 0805 100K %1 1/8W  [R0805_ENKO]  -7.7,34.75 270 top
R89  1200970516**RES 0603 22K %5 1/10W  [R0603_ENKO]  -7.26,32.14 180 top
R90  1200970803**RES 0603 100K %1 1/10W  [R0603_ENKO]  -4.13,37.67 0 top
R91  1200970120**RES 0805 1K %1 1/8W  [R0805_ENKO]  -6.65,38.75 90 top
R92  1200970120**RES 0805 1K %1 1/8W  [R0805_ENKO]  -12.5,42.76 270 top
R93  1200970706**RES 0603 1K8 %5 1/10W  [R0603_ENKO]  -7.51,42.07 270 top
R95  1029-2003**RES 0603 10R %1  [R0603_ENKO]  -9.09,42.07 90 top
R96  1029-3416**RES 0805 47R %1 (AbC) (MX322)  [R0805_ENKO]  -8.7,38.75 90 top
R97  NC**TAKILMAYACAK  [R2512]  -17.8,20.18 270 top
R98  1029-6021**RES 2512 0R003 %1 2W  [R2512]  -22.08,20.19 270 top
R99  1200970583**RES 0603 1K %1 1/10W  [R0603_ENKO]  -10.67,42.06 270 top
R100  1200970522**RES 0603 1K %5 1/10W  [R0603_ENKO]  -25.28,14.37 90 top
R101  1200970522**RES 0603 1K %5 1/10W  [R0603_ENKO]  -26.87,14.37 270 top
R102  1029-2003**RES 0603 10R %1  [R0603_ENKO]  -13.55,53.37 0 top
R103  1200970803**RES 0603 100K %1 1/10W  [R0603_ENKO]  -14.24,46.06 270 top
R104  1029-2234**RES 0603 4K7 %1  [R0603_ENKO]  -25.49,11 90 top
R106  1200970156**RES 1206 22K %5 1/4W  [R1206_ENKO]  -9.54,52.98 180 top
R108  1200970583**RES 0603 1K %1 1/10W  [R0603_ENKO]  -34.42,9.73 90 top
R110  1200970803**RES 0603 100K %1 1/10W  [R0603_ENKO]  -12.66,46.06 270 top
R111  1029-6089**RES 0603 6K8 %5  [R0603_ENKO]  -36.04,12.71 90 top
R112  1200970528**RES 0603 0R %5 1/10W  [R0603_ENKO]  -3.38,53.36 0 top
R113  1029-2203**RES 0603 12K %1  [R0603_ENKO]  -5.78,52.65 90 top
R114  1029-2341**RES 0603 5K6 %1  [R0603_ENKO]  -5.78,49.67 90 top
R115  1029-2234**RES 0603 4K7 %1  [R0603_ENKO]  -4.14,41.42 180 top
R116  1200970583**RES 0603 1K %1 1/10W  [R0603_ENKO]  -2.39,46.63 90 top
R117  1200971020**RES 0603 10K %1 1/10W  [R0603_ENKO]  -4.66,47.33 0 top
R118  1200970522**RES 0603 1K %5 1/10W  [R0603_ENKO]  -37.63,12.71 270 top
R119  1200970121**RES 0805 1K %5 1/8W  [R0805_ENKO]  -4.32,43.92 180 top
R121  1200970522**RES 0603 1K %5 1/10W  [R0603_ENKO]  -39.89,12.74 90 top
R122  1200970518**RES 0603 10K %5 1/10W  [R0603_ENKO]  -37.97,9.74 90 top
R123  1200970522**RES 0603 1K %5 1/10W  [R0603_ENKO]  -46.01,12.6 180 top
R124  1200970522**RES 0603 1K %5 1/10W  [R0603_ENKO]  -43.03,12.62 180 top
R128  1200970515**RES 0603 100K %5 1/10W  [R0603_ENKO]  -11.79,20.49 180 top
R132  1200970522**RES 0603 1K %5 1/10W  [R0603_ENKO]  -4.93,22.85 90 top
R135  1200970516**RES 0603 22K %5 1/10W  [R0603_ENKO]  -4.13,19.81 270 top
R139  NC**TAKILMAYACAK  [R0603_ENKO]  -3.09,13 180 top
R140  1200970522**RES 0603 1K %5 1/10W  [R0603_ENKO]  -5.59,13.8 90 top
R141  1200970522**RES 0603 1K %5 1/10W  [R0603_ENKO]  -7.92,16.8 270 top
R142  1200970518**RES 0603 10K %5 1/10W  [R0603_ENKO]  -9.85,16.77 90 top
R144  1029-2337**RES 0603 39K %1  [R0603_ENKO]  -9.11,10.3 180 top
R146  1200970585**RES 0603 1M %5 1/10W  [R0603_ENKO]  -9.51,19.79 90 top
R148  1029-6015**RES 1206 56K %5  [R1206_ENKO]  -11.8,12 90 top
T1  1109-1016**Transistor NPN 3A 100V 15W Hfemin:10 DPAK Diodes MJD31C-13  [DPAK]  -74.31,76.12 0 top
T2  1109-4205**Mosfet N-Ch 220mA 50V Rds:1.16R SOT-23 INFINEON BSS138  [SOT-23]  -98.24,90.6 180 top
T3  1200980091**TRANS SMD PNP BC857B SOT-23  [SOT23-BEC]  -4.7,34.65 90 top
T5  1200980539**TRANS SM PNP NSS1C200LT1G SOT-23 100V 3A  [SOT23-BEC]  -8.65,13.31 270 top
TRF1  0319-7470**SMPS TRAFO 300W LLC E42/21/15 300uH DBC2 [ARGE?]-DENEME  [DEIF_TRF_300W_2]  -24.45,76.65 270 top
U1  1039-2420**PFC Controller CCM Mode Texas Instruments UCC28019A  [UCC28180]  -76.23,105.5 270 top
U2  0319-7472**INDUCTOR 300W LLC-2 TOROID DBC2 [ARGE?]-DENEME  [IND_TOROID]  -110.2,105.37 90 top
U3  1039-2421**LLC Controller Texas Instruments UCC256301  [SOIC16_UCC256301]  -55.65,92 0 top
U4  0319-7471**INDUCTOR 300W LLC TOROID DBC2 [ARGE?]-DENEME  [IND_TOROID]  -22.48,109.41 0 top
U$1  [EN-KO_AMLEMI]  -75.41,42.03 0 top
U$2  [ROHS]  -98.87,40.5 0 top
U$3  [FT-ICT]  -32.99,75.08 0 bottom
U$4  [ROHS]  -21.53,75.03 0 bottom
U$5  [EN-KO_AMLEMI]  -13.5,74.76 0 bottom
VR1  0169-3008**Varistor 20mm 360VAC 470VDC (AbC)  [VITRA_VARISTOR]  -111.99,30.05 0 top
X1  0289-1462**GMSTBA 2.5/ 3-G-7.62 (Phoenix 1766246)  [GMSTBA3]  -109.57,0.61 0 top
X1-K  0289-1463**GMVSTBR 2.5/ 3-ST-7.62 (Phoenix 1832536)  [SOKET]  -107.12,141.3 0 top
X2-K  0289-1461**MVSTBR 2.5/ 4-ST-5.08 (Phoenix 1792265)  [SOKET]  -110.93,141.3 0 top
X4  0289-1460**MSTBA 2.5/ 4-G-5.08 (Phoenix 1757268)  [MSTBA4]  -13.43,0.61 0 top
Z1  1129-1145**ZENER SOT23 0.3W 15V BZX84C15  [SOT23]  -77.15,68.28 90 top
Z2  1129-1152**ZENER SOT23 10V 0.4W BZX84-C10  [SOT23]  -95.55,99.61 90 top
Z3  1129-1150**ZENER SOT23 6V2 225mW BZX84C6V2 (AbC)  [SOT23]  -51.35,80.97 270 top
Z5  1129-1163**ZENER SOT23 20V 400mW %5 BZX84C20V  [SOT23]  -50.41,11.54 90 top
Z6  1129-1152**ZENER SOT23 10V 0.4W BZX84-C10  [SOT23]  -40.97,9.53 90 top
Z8  NC**TAKILMAYACAK  [SOT23]  -5.52,10.69 90 top
Z9  1129-1150**ZENER SOT23 6V2 225mW BZX84C6V2 (AbC)  [SOT23]  -7.4,26.17 90 top

## Tracks (layer width: path | path; a pad name or v marks a point on that pad's centre or on a via)
30V  (via drill 0.35)
  Top 0.61: OC2.1 -50.52,59.14 -50.52,57.43 v-50.61,57.34 | C59.1 -41.52,19.2 -42.99,17.73 -47.48,17.73 | -47.48,17.73 -47.53,17.73 | -47.53,17.73 C65.+1 | C108.2 -12.78,28.03 -13.88,29.13 -15.49,29.13 v-15.49,29.1 | -47.48,17.73 -48.96,18.77 | -47.48,17.73 -48.96,16.69 | -47.53,17.73 -49.26,18.59 | -47.53,17.73 -49.26,16.87
  Top 0.813: R112.2 -2.05,53.9 -2.05,58.09 -3.86,59.9 TRF1.13
  Top 1.27: R148.1 -11.8,6.6 X4.3
  Bottom 0.406: C62.+1 -15.62,34.33 | -15.62,34.33 -15.62,34.73 | -15.62,34.73 -15.62,57.48 | -15.62,57.48 -15.62,58.27 | -15.62,58.27 -15.62,58.47 | -15.62,58.47 -15.62,59.9 | -15.62,34.73 -16.64,33.6 | -15.62,34.73 -14.6,33.6 | -15.62,34.33 -16.43,33.37 | -15.62,34.33 -14.81,33.37 | -15.62,58.27 -15.65,59.93 | -15.62,58.27 -17.23,58.63 | -15.62,57.48 -15.65,58.94 | -15.62,57.48 -17.07,57.61 | -15.62,58.47 -15.65,59.93 | -15.62,58.47 -17.07,58.61
  Bottom 0.61: v-50.61,57.34 -43.96,57.34 | -43.96,57.34 -42.98,57.34 -42.82,57.5 | TRF1.6.1 -41.95,58.38 -42.82,57.5 | v-15.49,29.1 -15.62,28.97 -15.62,28.96 | -43.96,57.34 -41.74,57.73 | -43.96,57.34 -43.04,59.4 | -42.82,57.5 -41.15,59.01 | -42.82,57.5 -43.13,59.73
  Bottom 1.5: TRF1.25 -7.95,59.9 TRF1.46 TRF1.31 | C62.+1 -15.62,28.96 -15.62,21.1 -17.87,18.85 C64.+1 -34,17.73 C65.+1 -50.69,18.73 C61.+1 -67.54,19.87 -79.84,19.87 C58.3 | C110.1 -80.36,5.93 C111.1 -80.38,3.85 -78.33,1.8 -63.28,1.8 -63.24,1.84 | -63.24,1.84 -12.37,1.84 -10.89,3.32 X4.3 | JP5.7 -61.37,3.71 -63.24,1.84
  pour Bottom (isolate 0.305, rank 2, no thermals): -18.32,53.85 -17.49,53.02 -16.47,53.02 -15.66,52.21 -15.66,47.45 -17.57,45.54 -17.57,28.42 -25.48,20.51 -72.92,20.51 -73.38,20.05 -73.38,9.99 -72.55,9.16 -14.56,9.16 -13.15,7.75 -13.15,1.81 -12.7,1.36 -1.98,1.36 -1.13,2.21 -1.13,67.49 -2.25,68.61 -17.47,68.61 -18.31,67.77 -18.31,57.62
  pour Bottom (isolate 0.305, no thermals): -43.09,66.91 -41.39,68.61 -17.02,68.61 -16.67,68.26 -16.67,63.72 -17.4,62.99 -39.25,62.99 -40.68,61.56 -40.68,58.21 -40.66,58.19 -41.2,57.65 -42.56,57.65 -43.09,58.18
  pour Bottom (isolate 0.305, no thermals): -43.16,57.87 -42.9,57.61 -35.99,57.61 -35.6,58 -35.6,62.09 -34.39,63.3 -34.39,64.37 -34.74,64.72 -41.93,64.72 -43.14,63.51 -43.16,63.49
  pour Top (isolate 0.305, no thermals): -43.11,18.99 -42.04,20.06 -42.04,26.49 -41.86,26.67 -40.99,26.67 -40.87,26.55 -40.87,17.9 -41.83,16.94 -42.35,16.42 -49.59,16.42 -50.26,16.42 -50.71,16.87 -50.71,18.48 -50.32,18.87 -50.2,18.99
  pour Bottom (isolate 0.305, no thermals): -62.04,4.8 -64.47,2.37 -64.47,1.64 -64.12,1.29 -57.31,1.29 -57.11,1.49 -57.11,2.09 -57.28,2.26 -58.4,2.26 -60.74,4.6 -60.74,8.97 -61.06,9.29 -61.88,9.29 -62.04,9.13
  pour Top (isolate 0.305, no thermals): -9.93,1.73 -10.31,1.35 -12.22,1.35 -12.41,1.54 -12.56,1.69 -12.56,10.7 -12.19,11.07 -11.27,11.07 -11.03,10.83 -11.03,10.2 -11.03,8.89 -10.63,8.49 -9.93,7.79
+3V3  (via drill 0.35)
  Top 0.305: C79.1 -28.37,12.23 IC5.8
  Top 0.406: R135.2 -3.44,19.02 -3.07,19.39 -3.07,28.78 -4.2,29.91 -9.44,29.91 -10.84,31.3 -10.84,34.31 -15.3,38.77 -23.96,38.77 -28.75,33.98 -31.54,33.98 -35.91,29.61 -56.78,29.61 -57.55,28.85 -57.55,15.64 -54.69,12.79 -54.69,6.4 | C79.1 -28.4,13.71 -28.4,14.25 | -28.4,14.25 -28.4,14.68 -28.37,14.71 v-28.37,14.89 | -28.4,14.25 -28.2,14.84 v-28.37,14.89 | -28.4,14.25 -28.54,14.85 v-28.37,14.89
  Top 0.61: v-32.2,6.36 -32.25,6.4 -54.69,6.4 -58.05,6.4 -58.83,7.18 -58.83,7.4 | -58.83,7.4 JP5.9 | -58.83,7.4 -58.41,8.52 | -58.83,7.4 -59.25,8.52
  Bottom 0.406: v-28.37,14.89 -28.82,14.44 | -28.82,14.44 -29.33,13.93 -31.64,13.93 | -31.64,13.93 -32.26,13.93 v-32.28,13.91 | -28.82,14.44 -28.29,14.74 v-28.37,14.89 | -28.82,14.44 -28.52,14.98 v-28.37,14.89 | -31.64,13.93 -32.24,14.08 v-32.28,13.91 | -31.64,13.93 -32.23,13.75 v-32.28,13.91
  Bottom 0.61: v-32.2,6.36 -32.2,13.84 v-32.28,13.91
  pour Top (isolate 0.305, no thermals): -59.44,6.83 -59.05,6.44 -58.83,6.22 -57.42,6.22 -35.79,6.22 -35.47,6.54 -35.47,7.19 -35.93,7.65 -57.8,7.65 -58.2,8.05 -58.2,8.75 -58.2,8.93 -58.53,9.26 -58.57,9.3 -59.08,9.3 -59.44,8.94
+12V  (via drill 0.35)
  Top 0.406: -57.81,52.41 -55.59,54.63 | -55.59,54.63 -55.44,54.78 | -55.44,54.78 -55.21,55.01 -55.21,55.43 | -57.81,52.41 -68.85,52.41 -70.62,50.63 -70.62,46.75 -70.61,46.74 -70.61,46.7 -69.33,45.42 -69.33,34.96 -69.54,34.75 | C50.2 -58.34,41.24 IC2.1 -54.98,41.24 -54.62,40.88 -54.62,37.27 | -54.62,37.27 -54.62,37.25 -54.16,36.79 v-54.16,36.82 | IC3.1 -32.87,41.45 -32.21,40.8 -32.21,37.19 -32.34,37.05 | -53.66,34.93 -48.85,34.93 -46.27,32.35 -37.05,32.35 -32.34,37.05 | -53.66,34.93 v-54.3,34.93 | R102.1 -14.71,53.74 -18.3,53.74 | v-18.93,53.59 -18.79,53.74 -18.3,53.74 | OC1.1 -55.21,55.96 | -55.21,55.96 -55.21,55.43 | -55.44,54.78 -55.12,54.78 | -55.12,54.78 -54.68,54.78 | -54.68,54.78 -54.56,54.78 | -54.56,54.78 -54.14,54.78 | v-53.26,54.78 -53.9,54.78 | -53.9,54.78 -54.14,54.78 | R128.2 -12.58,20.59 -11.21,21.96 C98.2 -10.61,22.42 -10.22,22.8 -10.22,26.93 -10.53,27.24 -10.87,27.24 | v-11.51,27.24 -10.87,27.24 | v-11.5,28.99 -11.96,29.45 | -11.96,29.45 -12.73,30.22 -12.73,33.48 -16.07,36.83 -23.26,36.83 -28.11,31.98 -30.01,31.98 | -30.01,31.98 -30.63,31.98 | -30.63,31.98 | -30.63,31.98 v-30.63,31.8 | v-31.34,36.9 -31.99,36.9 | -31.99,36.9 -32.19,36.9 -32.34,37.05 | C72.1 -71.74,13.38 | -69.54,34.75 v-69.99,34.29 | v-67.67,33.29 -67.67,32.97 -67.94,32.7 | -67.94,32.7 -68.03,32.61 | -67.62,32.61 -67.67,32.56 | C75.1 -71.9,8.28 -71.74,8.12 | -55.21,55.43 -54.56,54.78 | -55.21,55.96 -54.84,55.59 | -54.84,55.59 -54.14,54.89 -54.14,54.78 | -57.81,52.41 -57.49,52.41 | -57.49,52.41 -55.12,54.78 | -57.49,52.41 -57.05,52.41 | -57.05,52.41 -54.68,54.78 | -57.05,52.41 -56.93,52.41 | -56.93,52.41 -54.56,54.78 | -54.14,54.78 -56.51,52.41 -56.93,52.41
  Top 0.406: -54.84,55.59 -54.84,58.98 OC1.1 | -55.44,54.78 -55.44,59.11 | -55.44,59.11 OC1.1 | -55.59,54.63 -55.59,58.97 -55.44,59.11 | -54.62,37.27 -54.31,36.73 v-54.16,36.82 | -54.62,37.27 -54.08,36.98 v-54.16,36.82 | -53.66,34.93 -54.25,35.1 v-54.3,34.93 | -53.66,34.93 -54.25,34.76 v-54.3,34.93 | -53.9,54.78 -53.31,54.61 v-53.26,54.78 | -53.9,54.78 -53.31,54.95 v-53.26,54.78 | -18.3,53.74 -18.92,53.77 v-18.93,53.59 | -18.3,53.74 -18.85,53.44 v-18.93,53.59 | -10.87,27.24 -11.46,27.41 v-11.51,27.24 | -10.87,27.24 -11.46,27.07 v-11.51,27.24 | -11.96,29.45 -11.65,28.91 v-11.5,28.99 | -11.96,29.45 -11.41,29.14 v-11.5,28.99 | v-30.63,31.8 -30.63,31.98 | -30.01,31.98 -30.54,31.65 v-30.63,31.8 | -31.99,36.9 -31.39,36.73 v-31.34,36.9 | -31.99,36.9 -31.39,37.07 v-31.34,36.9 | -69.54,34.75 -70.08,34.45 v-69.99,34.29 | -69.54,34.75 -69.84,34.21 v-69.99,34.29 | -67.94,32.7 -67.54,33.18 v-67.67,33.29 | -67.94,32.7 -67.84,33.32 v-67.67,33.29
  Top 0.508: IC3.1 -36.35,41.45 C56.2
  Top 0.61: C75.1 -72.08,7.42 -70.8,6.14 -64.58,6.14 -63.46,7.26 -63.46,7.48 | -63.46,7.48 -63.46,8.75 | -63.46,7.48 -63.46,8.68 | -63.46,7.48 -64.25,8.38
  Top 0.813: C55.2 C56.2 | C49.2 C50.2
  Top 1.016: JP5.5 -63.91,7.81 -64.88,6.84 -70.46,6.84 -71.74,8.12 | v-54.3,34.93 -54.46,34.77 -56.27,34.77 -58.43,32.61 -67.62,32.61 -68.03,32.61 -69.06,32.61 -71.78,29.89 C72.1 C73.1 C74.1 -71.78,8.59 C75.1
  Bottom 0.305: v-11.5,28.99 v-11.51,28.98
  Bottom 0.406: v-54.16,36.82 -54.16,36.18 | -54.16,36.18 -54.16,35.56 | -54.16,35.56 -54.16,35.08 v-54.3,34.94 v-54.3,34.93 | v-18.93,53.59 -19.05,53.47 -19.43,53.47 | -19.43,53.47 -19.56,53.47 | -19.56,53.47 -51.76,53.47 -52.72,54.43 | v-53.26,54.78 -53.07,54.78 -52.72,54.43 | v-11.51,28.98 -11.51,28.35 | -11.51,28.35 -11.51,27.88 | -11.51,27.88 v-11.51,27.24 | v-30.63,31.8 -30.63,32.44 | -30.63,32.44 -30.63,36.26 -30.86,36.48 | v-31.34,36.9 -31.27,36.9 -30.86,36.48 | v-69.99,34.29 -69.35,34.29 | -69.35,34.29 -68.24,34.29 -67.86,33.91 | v-67.67,33.29 -67.67,33.72 -67.86,33.91 | -54.16,36.18 -53.99,36.77 v-54.16,36.82 | -54.16,36.18 -54.33,36.77 v-54.16,36.82 | -54.16,35.56 -54.45,35.01 v-54.3,34.93 | -54.16,35.56 -54.12,34.94 v-54.3,34.93 | -52.72,54.43 -53.13,54.89 v-53.26,54.78 | -52.72,54.43 -53.31,54.61 v-53.26,54.78 | -19.56,53.47 -18.95,53.42 v-18.93,53.59 | -19.43,53.47 -18.98,53.7 v-18.93,53.59 | -11.51,27.88 -11.68,27.29 v-11.51,27.24 | -11.51,27.88 -11.34,27.29 v-11.51,27.24 | -11.51,28.35 -11.33,28.94 v-11.5,28.99 -11.67,28.95 -11.51,28.35 | -30.63,32.44 -30.8,31.85 v-30.63,31.8 | -30.63,32.44 -30.46,31.85 v-30.63,31.8 | -30.86,36.48 -31.2,37 v-31.34,36.9 | -30.86,36.48 -31.42,36.74 v-31.34,36.9 | -69.35,34.29 -69.95,34.46 v-69.99,34.29 | -69.35,34.29 -69.95,34.13 v-69.99,34.29 | -67.86,33.91 -67.84,33.29 v-67.67,33.29 | -67.86,33.91 -67.52,33.38 v-67.67,33.29
  pour Top (isolate 0.305, no thermals): -56.18,35.3 -52.47,35.3 -48.04,35.3 -46.82,34.08 -45.92,33.18 -45.92,32.48 -45.92,32.46 -46.2,32.18 -57.92,32.18 -58.18,32.44 -58.18,33.3
BLK  (via drill 0.35)
  Top 0.406: -54.72,85.92 -55.5,86.71 | -55.5,86.71 -56.3,87.5 U3.4 | C29.2 -54.72,85.72 | -54.72,85.72 -54.72,85.92 | v-55.01,86.3 -54.72,86.01 -54.72,85.92 | -69.41,109.71 -68.72,110.4 -68.37,110.4 | v-64.08,110.4 -64.72,110.4 | -64.72,110.4 -68.2,110.4 | -68.2,110.4 -69.4,109.2 -69.41,109.2 | -68.2,110.4 -68.37,110.4 | -68.37,110.4 -69.07,111.1 -69.26,111.1 R41.1 | -64.72,110.4 -64.13,110.23 v-64.08,110.4 | -64.72,110.4 -64.13,110.57 v-64.08,110.4 | -55.5,86.71 -55.15,86.2 v-55.01,86.3 | -55.5,86.71 -54.94,86.45 v-55.01,86.3 | -54.72,85.72 -54.84,86.33 v-55.01,86.3 | -54.72,85.72 -55.14,86.18 v-55.01,86.3
  Top 0.813: R42.2 -69.41,109.2 -69.41,109.71 -69.41,110.53 R41.1
  Bottom 0.406: -54.69,86.85 -54.69,93.65 -55.61,94.57 -61.81,94.57 -65.1,97.85 -65.1,99.51 -64.6,100.01 -62.95,100.01 -62.15,100.81 -62.15,108.8 -63.49,110.14 | -54.69,86.85 -54.69,86.61 v-55.01,86.3 | -63.49,110.14 -63.75,110.4 v-64.08,110.4 | -63.49,110.14 -63.97,110.53 v-64.08,110.4 | -63.49,110.14 -64.1,110.23 v-64.08,110.4 | -54.69,86.85 -55.13,86.42 v-55.01,86.3 | -54.69,86.85 -54.84,86.25 v-55.01,86.3
BW
  Top 0.406: U3.8 -51.22,88.08 -49.95,86.81 -47.74,86.81 -47.13,86.2 -47.13,79.92 -48.27,78.78 -51.36,78.78 | -51.36,78.78 -52.3,77.84 R2.2 | -51.36,78.78 -51.81,78.78 | -52.94,77.65 -51.81,78.78 | -51.81,78.78 -52.27,78.78 -53.54,77.51 R3.2
  Top 0.61: R3.2 R2.2
CUT_OFF_OUTPUT  (via drill 0.35)
  Top 0.305: R135.1 -3.75,20.98 -3.75,28.52 -4.45,29.22 -9.73,29.22 -11.48,30.98 -11.48,34.02 -15.57,38.11 -23.71,38.11 -28.52,33.3 -31.25,33.3 -35.63,28.92 -56.17,28.92 -56.91,28.18 -56.91,16.24 -55.94,15.27 | -55.94,15.27 -55.83,15.16 | -55.83,15.16 v-55.48,14.81 | -55.94,15.27 -55.69,14.72 v-55.48,14.81 | -55.83,15.16 -55.41,14.97 v-55.48,14.81
  Top 0.813: C103.1 -6.43,20.59 | -6.43,20.59 D18.A | R135.1 -6.42,20.6 -6.43,20.59
  Bottom 0.406: v-55.48,14.81 -55.56,14.89 -56.12,14.89 | -56.12,14.89 -63.24,14.89 -63.91,14.22 -63.91,12.5 | -63.91,12.5 JP5.6 | -56.12,14.89 -55.55,14.65 v-55.48,14.81 | -56.12,14.89 -55.51,14.98 v-55.48,14.81 | -63.91,12.5 -64.41,11.46 | -63.91,12.5 -63.41,11.46
  pour Bottom (isolate 0.305, no thermals): -64.51,14.54 -63.89,15.16 -55.38,15.16 -55.21,14.99 -55.21,14.65 -55.27,14.59 -62.68,14.59 -63.05,14.22 -63.31,13.96 -63.31,11.35 -63.31,10.95 -63.66,10.6 -64.18,10.6 -64.33,10.75 -64.51,10.93
GATE1  (via drill 0.35)
  Top 0.406: Q14.3 -12.62,18.12 -12.62,18.75 -11,20.38 R128.1
  Top 0.61: -13.44,17.3 Q14.3 -13.88,16.86 v-13.88,15.86 | Q12.3 -9.44,22.55 -9.44,20.65 R146.2 -9.65,20.45 -9.69,20.49 | IC8.GATE v-22.52,15.2
  Top 0.813: R128.1 -10.83,20.65 -9.44,20.65 | Z9.3 -9.04,25.63 Q12.3
  Bottom 0.61: v-13.88,15.86 -14.54,15.2 v-22.52,15.2
GND  (via drill 0.35)
  Top 0.406: C17.2 -77.06,110.83 -79.03,108.86 | -79.03,108.86 -79.03,108.38 | -79.03,108.38 -79.03,107.98 | -79.03,107.98 U1.1 | U1.1 -79.06,107.41 -79.59,107.93 | v-80.23,107.98 -79.64,107.98 | -79.59,107.93 -79.64,107.98 | C19.2 -69.18,103.31 R16.1 -69.1,102.82 -68.48,102.2 -67.12,102.2 | -70.97,98.53 -71.35,98.53 -71.41,98.59 -71.41,99.58 -71.44,99.61 -71.44,99 -71.14,98.69 | -70.97,98.53 -70.72,98.53 | -70.72,98.53 -70.42,98.53 | -70.42,98.53 -70.07,98.53 | -70.07,98.53 -69.86,98.53 | -69.86,98.53 -68.21,98.53 | -68.21,98.53 -68.11,98.63 | -67.26,99.48 C18.2 | -67.12,102.2 -66.63,102.2 -66.23,101.79 -66.23,100.12 -66.87,99.48 | -66.87,99.48 -67.26,99.48 | -67.12,102.2 -67.03,102.29 R43.1 -65.59,103.39 | -65.59,103.39 -65.06,103.39 -64.18,104.26 C22.2 | U3.11 -53.74,93.78 -52.96,92.99 | v-52.39,92.68 -52.65,92.68 -52.96,92.99 | R49.2 -47.62,99 -46.39,97.77 -46.39,97.49 | -46.39,97.49 v-46.39,96.85 | v-74.53,97.91 -74.53,98.51 -74.57,98.55 | -74.57,98.55 -74.61,98.59 | R31.2 -51.12,85.05 | -54.5,83.77 C29.1 | -55.9,75.84 -55.9,77 -55.39,77.51 | C9.1 -67.78,78.47 C26.- | -79.64,107.98 -79.59,107.98 | -79.59,107.98 -79.43,107.98 | -79.43,107.98 -79.03,107.98 | v-80.23,107.98 -79.91,107.98 -79.64,108.25 | -79.64,108.25 -79.03,108.86 | -79.43,107.98 -79.03,108.38 | -79.7,107.62 -79.48,107.41 U1.1 | -79.7,107.62 -80.06,107.98 v-80.23,107.98 | -72.37,98.59 -71.93,99.03 -71.93,99.61 -71.75,99.43 -71.75,98.59 | -70.97,98.53 -71.14,98.69 | -71.14,98.69 -71.14,99.23 -70.89,99.47 | -70.89,99.47 -70.76,99.61 | -70.72,98.53 -70.89,98.7 -70.89,99.47 | -70.42,98.53 -70.72,98.83 -70.72,99.18 | -70.07,98.53 -70.72,99.18 | -70.72,99.18 -70.72,99.39
  Top 0.406: -69.86,98.53 -70.13,98.8 | -70.13,98.8 -70.72,99.39 | -70.72,99.39 C16.2 -70.54,99.57 -69.78,98.8 | -70.13,98.8 -69.78,98.8 | -69.78,98.8 -69.61,98.63 -68.11,98.63 | -68.11,98.63 -67.26,99.48 | -68.21,98.53 -67.82,98.53 -66.87,99.48 | -79.59,107.93 -80.17,108.14 v-80.23,107.98 | -79.59,107.93 -80.2,107.81 v-80.23,107.98 | -79.59,107.98 -80.18,108.15 v-80.23,107.98 | -79.59,107.98 -80.18,107.81 v-80.23,107.98 | -79.64,108.25 -80.26,108.15 v-80.23,107.98 | -79.64,108.25 -80.12,107.85 v-80.23,107.98 | -79.7,107.62 -80.1,108.09 v-80.23,107.98 | -79.7,107.62 -80.28,107.81 v-80.23,107.98 | -52.96,92.99 -52.51,92.55 v-52.39,92.68 | -52.96,92.99 -52.35,92.85 v-52.39,92.68 | -46.39,97.49 -46.56,96.9 v-46.39,96.85 | -46.39,97.49 -46.22,96.9 v-46.39,96.85 | -74.57,98.55 -74.7,97.95 v-74.53,97.91 | -74.57,98.55 -74.37,97.97 v-74.53,97.91 | -65.59,103.39 -64,103.73 | -65.59,103.39 -65.02,104.91
  Top 0.508: T2.2 -99.02,91.87 | C13.2 -72.32,99.18 -72.91,98.59 | -72.91,98.59 -74.61,98.59 -76.6,98.59 | -76.6,98.59 -77.89,98.59 R14.1 | C14.2 -76.46,98.73 -76.6,98.59 | -72.91,98.59 -72.37,98.59 -71.75,98.59 -71.41,98.59 | -47.73,99.01 R49.2 | C7.1 -56,75.45 -56.44,75.45 | -56.44,75.45 -57.05,75.45 v-57.08,75.42 | v-52.58,73.04 -52.58,73 -52.55,72.97 | -56.44,75.45 -57.06,75.54 v-57.08,75.42 | -56.44,75.45 -57.05,75.3 v-57.08,75.42
  Top 0.61: C26.- -65.94,77.18 -57.15,77.18 | -56.42,77.91 v-56.42,80.76 C23.2 | -57.15,77.18 -56.42,77.91 | v-49.43,82.2 -49.73,82.5 C28.2 | R3.1 -55.39,77.51 -56.02,77.51 -56.42,77.91 | Z1.1 -75.84,67.54 C11.1 -72.58,67.54 C10.1 -71.12,67.61 -71.09,67.64 v-70.93,67.64 | v-70.43,77.65 -70.43,76.54 C9.1 | OC2.3 -47.79,72.21 -48.76,73.18 -52.34,73.18 -52.55,72.97 -52.67,72.85 OC1.3 | -55.9,77 -56.09,77.18 -56.56,77.18 | -56.56,77.18 -57.15,77.18 | -56.56,77.18 -55.9,76.52 -55.9,75.84
  Top 0.813: Q2.S -95.72,108.61 -96.84,109.73 R22.2 | Q1.2 -96.72,96.38 v-97.2,96.38 R7.1 -98.89,96.27 C12.2 -98.87,94.85 R10.1 -98.87,92.02 T2.2 | R20.2 R19.2 -68.09,93.98 -68.07,94 v-67.7,94 | C17.2 C15.2 | C32.2 -47.73,99.01 | C13.2 -71.93,99.61 -71.44,99.61 -70.76,99.61 C16.2 | -50.25,85.06 -49.74,85.06 C30.2 -49.73,84.31 | -50.25,85.06 R31.2 -51.13,84.23 | -51.13,84.23 C25.2 C28.2 -49.73,84.31 | -49.73,84.31 -49.81,84.23 -50.62,84.23 | -50.62,84.23 -51.13,84.23 | -50.25,85.06 -50.25,84.6 -50.62,84.23 | C29.1 C27.2 -56.42,83.44 C23.2 | C7.1 -55.9,75.84 -55.9,76.88 R3.1
  Top 1.5: C31.2 -9.97,129.87 -8.85,128.75 Q4.3 | C22.2 -60,104.6 -58.08,106.52 -58.08,112.49 C38.-
  Bottom 0.406: -51.97,93.17 -51.65,93.49 -46.5,93.49 | -51.97,93.17 -52.39,92.75 v-52.39,92.68 | -46.5,93.49 -44.05,93.49 | -44.05,93.49 -43.03,93.49 | -43.03,93.49 | -43.03,93.49 -42.04,93.49 TRF1.4 | v-46.39,96.85 -46.39,96.21 | -46.39,96.21 -46.39,93.6 -46.5,93.49 | v-97.2,96.38 -97.2,95.73 | -97.2,95.73 -97.2,95.72 -96.8,95.32 -75.37,95.32 -74.36,96.33 -74.36,97.29 | -74.36,97.29 -74.36,97.91 | -74.36,97.91 v-74.53,97.91 | -51.97,93.17 -52.49,92.83 v-52.39,92.68 | -51.97,93.17 -52.23,92.61 v-52.39,92.68 | -46.39,96.21 -46.22,96.8 v-46.39,96.85 | -46.39,96.21 -46.56,96.8 v-46.39,96.85 | -97.2,95.73 -97.03,96.33 v-97.2,96.38 | -97.2,95.73 -97.37,96.33 v-97.2,96.38 | -74.36,97.29 -74.36,97.91 | v-74.53,97.91 -74.36,97.91 | -74.36,97.29 -74.68,97.82 v-74.53,97.91 | -44.05,93.49 -42.79,92.42 | -44.05,93.49 -42.71,94.45 | -43.03,93.49 -41.66,93.87 | -43.03,93.49 -43.02,94.91 -43.03,93.49 | -43.03,93.49 -41.66,93.88
  Bottom 0.508: v-57.08,75.42 -56.43,75.42 | -56.43,75.42 -53.62,75.42 -52.57,74.37 -52.57,73.69 | v-52.58,73.04 v-52.57,73.05 -52.57,73.69 | -56.43,75.42 -57.05,75.54 v-57.08,75.42 | -56.43,75.42 -57.05,75.3 v-57.08,75.42 | -52.57,73.69 -52.7,73.07 v-52.58,73.04 | -52.57,73.69 -52.45,73.06 v-52.58,73.04
  Bottom 0.61: v-49.43,82.2 -49.47,82.16 -49.47,82.09 -49.45,82.07 -49.45,81.36 -50.05,80.76 v-56.42,80.76 -58.23,80.76 -59.48,82.01 -66.61,82.01 -67.7,83.1 v-67.7,94 | v-70.43,77.65 -70.51,77.65 -70.93,77.23 v-70.93,67.64 -70.93,63.79 -72.62,62.1 -76.91,62.1 | C33.2 -76.91,62.1 | -76.91,62.1 -78.43,62.81 | -76.91,62.1 -78.43,61.39
  Bottom 0.813: Q2.S -87.33,108.61 | C21.1 -85.95,105.77 -85.95,107.23 -87.33,108.61 | -87.33,108.61 -80.86,108.61 | -80.86,108.61 v-80.23,107.98 | -80.86,108.61 -70.67,108.61 -67.88,105.82 -67.88,103.9 | v-67.7,94 -67.88,94.18 -67.88,103.9 | C22.2 -67.18,104.6 -67.88,103.9
  Bottom 1.5: -41.76,110.8 -12.04,110.8 -8.85,113.99 Q4.3 | -41.76,110.8 -53.24,110.8 -55.56,113.12 C38.- | -41.95,94.86 -41.95,110.61 -41.76,110.8 | C33.2 -78.76,57.95 R51.1 -76.71,57.57 C24.P$1
  Bottom 2.54: TRF1.4 -41.95,94.86 TRF1.26 TRF1.4 | TRF1.4 TRF1.48
  other vias: -67.7,93.2 -67.7,92.4 -67.7,91.6 -67.7,90.8 -67.7,90 -66.9,93.9 -66.9,93.1 -66.9,92.3 -66.9,91.5 -66.9,90.7 -66.1,93.9 -66.1,93.1 -66.1,92.3 -66.1,91.5 -65.3,93.9 -65.3,93.1 -65.3,92.3 -64.5,93.9 -64.5,93.1 -63.7,93.9
  pour Top (isolate 0.305, no thermals): -16.38,131.64 -16.15,131.87 -8.81,131.87 -8.2,131.26 -8.2,120.86 -8.62,120.44 -9.04,120.44 -9.47,120.87 -9.47,125.41 -12.05,127.99 -15.95,127.99 -16.38,128.42
  pour Bottom (isolate 0.305, no thermals): -16.36,131.64 -16.13,131.87 -8.79,131.87 -8.18,131.26 -8.18,120.86 -8.6,120.44 -9.02,120.44 -9.45,120.87 -9.45,125.41 -12.03,127.99 -15.93,127.99 -16.36,128.42
  pour Bottom (isolate 0.305, no thermals): -8.17,108.93 -9.42,107.68 -31.49,107.68 -40.55,98.62 -40.55,89.1 -41.16,88.49 -42.85,88.49 -43.33,88.97 -43.33,105.43 -47.21,109.31 -62.56,109.31 -62.56,101.2 -63.14,100.62 -64.67,100.62 -65.67,99.62 -65.67,97.81 -61.91,94.05 -58,94.05 -55.78,91.83 -55.78,86.57 -54.5,85.29 -54.5,82.48 -53.73,81.71 -50.57,81.71 -49.6,82.68 -48.91,82.68 -48.73,82.5 -48.73,81.58 -50.38,79.93 -69.14,79.93 -71.17,81.96 -71.17,105.18 -75.49,109.5 -75.49,114.72 -73.06,117.15 -39.97,117.15 -34.23,111.41 -12.37,111.41 -9.46,114.32 -9.46,122.18 -9.33,122.31 -8.4,122.31 -8.17,122.08
  pour Bottom (isolate 0.305, no thermals): -40.7,88.45 -54.41,88.45 -55.02,89.06 -55.02,92.1 -57.74,94.82 -59.93,94.82 -60.34,95.23 -60.34,98.65 -59.71,99.28 -41.61,99.28 -40.56,98.23 -40.56,88.59
  pour Top (isolate 0.305, no thermals): -63.83,96.22 -63.17,95.56 -63.17,93.93 -69.13,87.97 -70.83,87.97 -71.08,88.22 -71.08,95.79 -70.65,96.22
  pour Bottom (isolate 0.305, no thermals): -78.87,56.15 -79.57,56.85 -79.57,91.65 -78.68,92.54 -74.44,92.54 -71.51,95.47 -67.97,95.47 -67.45,94.95 -67.45,82.02 -69.34,80.13 -69.34,57.73 -70.92,56.15
  pour Top (isolate 0.305, no thermals): -63.04,117.12 -63.33,116.83 -63.33,107.12 -63.63,106.82 -65.28,106.82 -65.69,106.41 -65.69,104.13 -66.11,103.71 -70.93,103.71 -71.15,103.49 -71.15,102.92 -70.82,102.59 -70.13,102.59 -69.57,102.03 -55.43,102.03 -54.96,102.5 -54.96,112.51 -53.36,114.11 -53.36,115.87 -54.61,117.12
  pour Bottom (isolate 0.305, no thermals): -90.47,109.24 -89.8,109.91 -89.8,112.48 -89.32,112.96 -77.25,112.96 -75.46,114.75 -74.76,114.75 -74.7,114.69 -74.7,112.09 -71.85,109.24 -71.85,108.37 -72.62,107.6 -83.99,107.6 -84.56,107.03 -84.56,105.32 -84.54,105.3 -84.87,104.97 -86.37,104.97 -86.8,105.4 -86.8,107.05 -87.22,107.47 -93.64,107.47 -94.02,107.85 -94.02,108.96 -93.74,109.24
  pour Top (isolate 0.305, no thermals): -57.62,75.89 -57.34,75.61 -55.59,75.61 -55.52,75.68 -55.52,77.06 -55.73,77.27 -55.8,77.34 -59.39,77.34 -63.73,77.34 -63.96,77.57 -63.96,79.88 -64.25,80.17 -70.2,80.17 -70.62,79.75 -70.62,76.26 -70.28,75.92 -70.25,75.89
  pour Bottom (isolate 0.305, no thermals): -35.72,88.4 -35.57,88.55 -35.57,104.26 -36.02,104.71 -40.45,104.71 -40.67,104.49 -40.67,88.66 -40.42,88.41 -40.41,88.4
GNDA  (via drill 0.35)
  Top 0.406: IC4.6 -8.49,51.39 -8.28,51.6 -7.16,51.6 -6.81,51.95 -6.81,54.09 | R99.2 -10.67,41.05 -9.99,40.37 -9.99,39.07 -9.67,38.75 -4.12,38.75 | -4.12,38.75 -3.73,38.75 -3.34,39.15 -3.34,40.08 -3.33,40.07 C78.1 -3.33,39.55 -4.12,38.75 | -6.4,54.51 -6.81,54.09 | -6.4,54.51 -6.38,54.52 -7.24,54.52 | v-3.45,55 -3.9,54.55 | -3.9,54.55 -3.94,54.51 -6.4,54.51 | R115.1 -3.33,41.44 -3.33,42.05 -3.56,42.28 | C91.1 -3.87,45.55 -4.25,45.17 -4.25,42.97 -3.56,42.28 | C80.1 -14.45,51.79 -15.37,52.71 -19.58,52.71 -19.9,53.03 -19.9,55.38 -19.63,55.65 -11.74,55.65 -10.61,54.52 -7.24,54.52 | -11.47,18.08 Q14.2 | -8.41,19.01 C103.2 | C92.1 -36.01,8.64 | v-15.25,16.53 -15.29,16.49 | -45.84,8.48 Q11.2 | -39.97,8.48 Z6.1 | C98.1 -13.32,22.42 -13.79,21.95 -13.79,19.93 | -13.79,19.93 v-13.79,19.29 | -6.81,54.09 -7.24,54.52 | -3.56,42.28 -3.56,41.1 | -71.9,5.21 -27.62,5.21 -27.55,5.14 | -26.93,7.32 -26.95,7.3 | -26.95,7.3 -26.95,5.74 | -26.95,7.3 -27.2,7.05 -27.2,5.49 | -3.9,54.55 -3.36,54.85 v-3.45,55 | -3.9,54.55 -3.6,55.09 v-3.45,55 | -13.79,19.93 -13.96,19.34 v-13.79,19.29 | -13.79,19.93 -13.62,19.34 v-13.79,19.29
  Top 0.508: R100.2 -25.28,16.46 -24.35,17.39 R98.2
  Top 0.61: v-4.26,17.41 -4.41,17.41 -5.91,18.91 -7.82,18.91 C103.2 -7.93,19 R146.1 | -36.01,8.64 -35.26,7.88 | -35.26,7.88 -33.36,7.88 | -33.14,8.1 -33.36,7.88 | -33.14,8.1 -32.73,8.51 -24.75,8.51 | -15.29,16.49 -17.04,16.49 | -24.75,8.51 -24.27,8.51 -24.27,8.43 -24.27,7.81 -24.55,7.54 | Q14.2 -10.99,18.5 -10.99,19.14 v-10.91,19.22 | R97.2 -17.8,17.62 | v-13.79,19.29 -14.54,19.29 -15.25,18.58 v-15.25,16.53 | C108.1 -11.2,24.28 -12.79,22.68 C98.1 | -27.97,4.71 -27.37,4.71 -26.48,5.59 | -26.48,5.59 -26.16,5.92 | -26.16,5.92 -25.79,6.29 | -25.79,6.29 -25.24,6.84 | -25.24,6.84 -24.55,7.54 | -46.06,8.7 Q11.2 | -24.55,7.54 -24.55,7.95 | -24.55,7.95 -24.55,8.3 -24.75,8.51 | -33.14,8.1 -24.7,8.1 -24.55,7.95 | -33.36,7.88 -25.79,7.88 | -25.79,7.88 -25.24,7.88 | -25.24,7.88 -24.61,7.88 -24.55,7.95 | -25.24,7.88 -25.24,6.84 | -25.79,7.88 -25.79,7.32 | -25.79,7.32 -25.79,6.29 | -35.26,7.88 -34.69,7.32 -26.93,7.32 | -26.26,7.32 -26.93,7.32 | -26.26,7.32 -25.79,7.32 | -26.48,6.88 -26.93,7.32 | -26.48,6.88 -26.31,6.7 | -26.31,6.7 -26.16,6.55 -26.16,5.92 | -26.26,7.32 -26.26,6.75 -26.31,6.7 | -26.48,6.88 -26.48,6.2 | -26.48,6.2 -26.48,5.59 | -26.48,6.2 -26.95,5.74 -27.2,5.49 -27.55,5.14 -27.97,4.71 | -27.97,4.71 -68.92,4.71 -68.95,4.74 | -68.95,4.74 -71.43,4.74 | -71.43,4.74 -72.18,4.74 | -72.18,4.74 -72.77,4.74 | -72.77,4.74 -73.22,4.74 | -73.22,4.74 -74.01,4.74 -75.04,5.77 C75.2 | v-68.99,4.79 -68.95,4.74 | C75.2 -75.29,8.03 | C75.2 -75.04,15.2 -76.82,16.98 -78.73,16.98 | C90.2 -78.73,16.98 | -73.22,4.74 -74.5,6.02 -74.5,6.47 | -74.5,7.81 -74.5,8.82 | -72.77,4.74 -74.5,6.47 | -74.5,6.47 -74.5,7.06 | -72.18,4.74 -74.5,7.06 | -74.5,7.06 -74.5,7.81 | -71.43,4.74 -71.9,5.21 -74.03,7.34
  Top 0.61: -74.03,7.34 -74.5,7.81 | -74.03,9.29 -74.03,7.34 | -78.73,16.98 -80.13,17.61 | -78.73,16.98 -80.13,16.35
  Top 0.813: R117.2 C91.1 -3.78,45.84 R116.1 -1.57,45.02 v-1.57,44.11 -1.48,44.02 v-1.48,17.63 -1.48,15.38 Q13.2 -2.15,13.15 R139.1 | R97.2 -17.59,17.59 | -17.04,16.49 IC8.S IC8.S1 IC8.S2 | -24.27,8.43 -23.04,9.66 -23.04,14.18 -23.73,14.87 v-23.73,15.16 | R115.1 -3.33,41.4 -3.33,40.07 | C92.1 R122.1 -38.44,8.48 -39.97,8.48 | Z6.1 -39.99,8.46 -39.99,8.43 -40.08,8.34 -45.7,8.34 -46.06,8.7 | Q11.2 -47.5,8.61 C95.1 | R146.1 -9.51,17.9 | -9.51,17.9 R142.2 | Q14.2 -9.66,18.05 -9.51,17.9
  Top 1.016: C72.2 C73.2 C74.2 -73.36,9.96 -74.03,9.29 -74.5,8.82 C75.2
  Top 1.5: R97.2 R98.2